# Altium project VNA.PrjPcb (part 1 of 2)
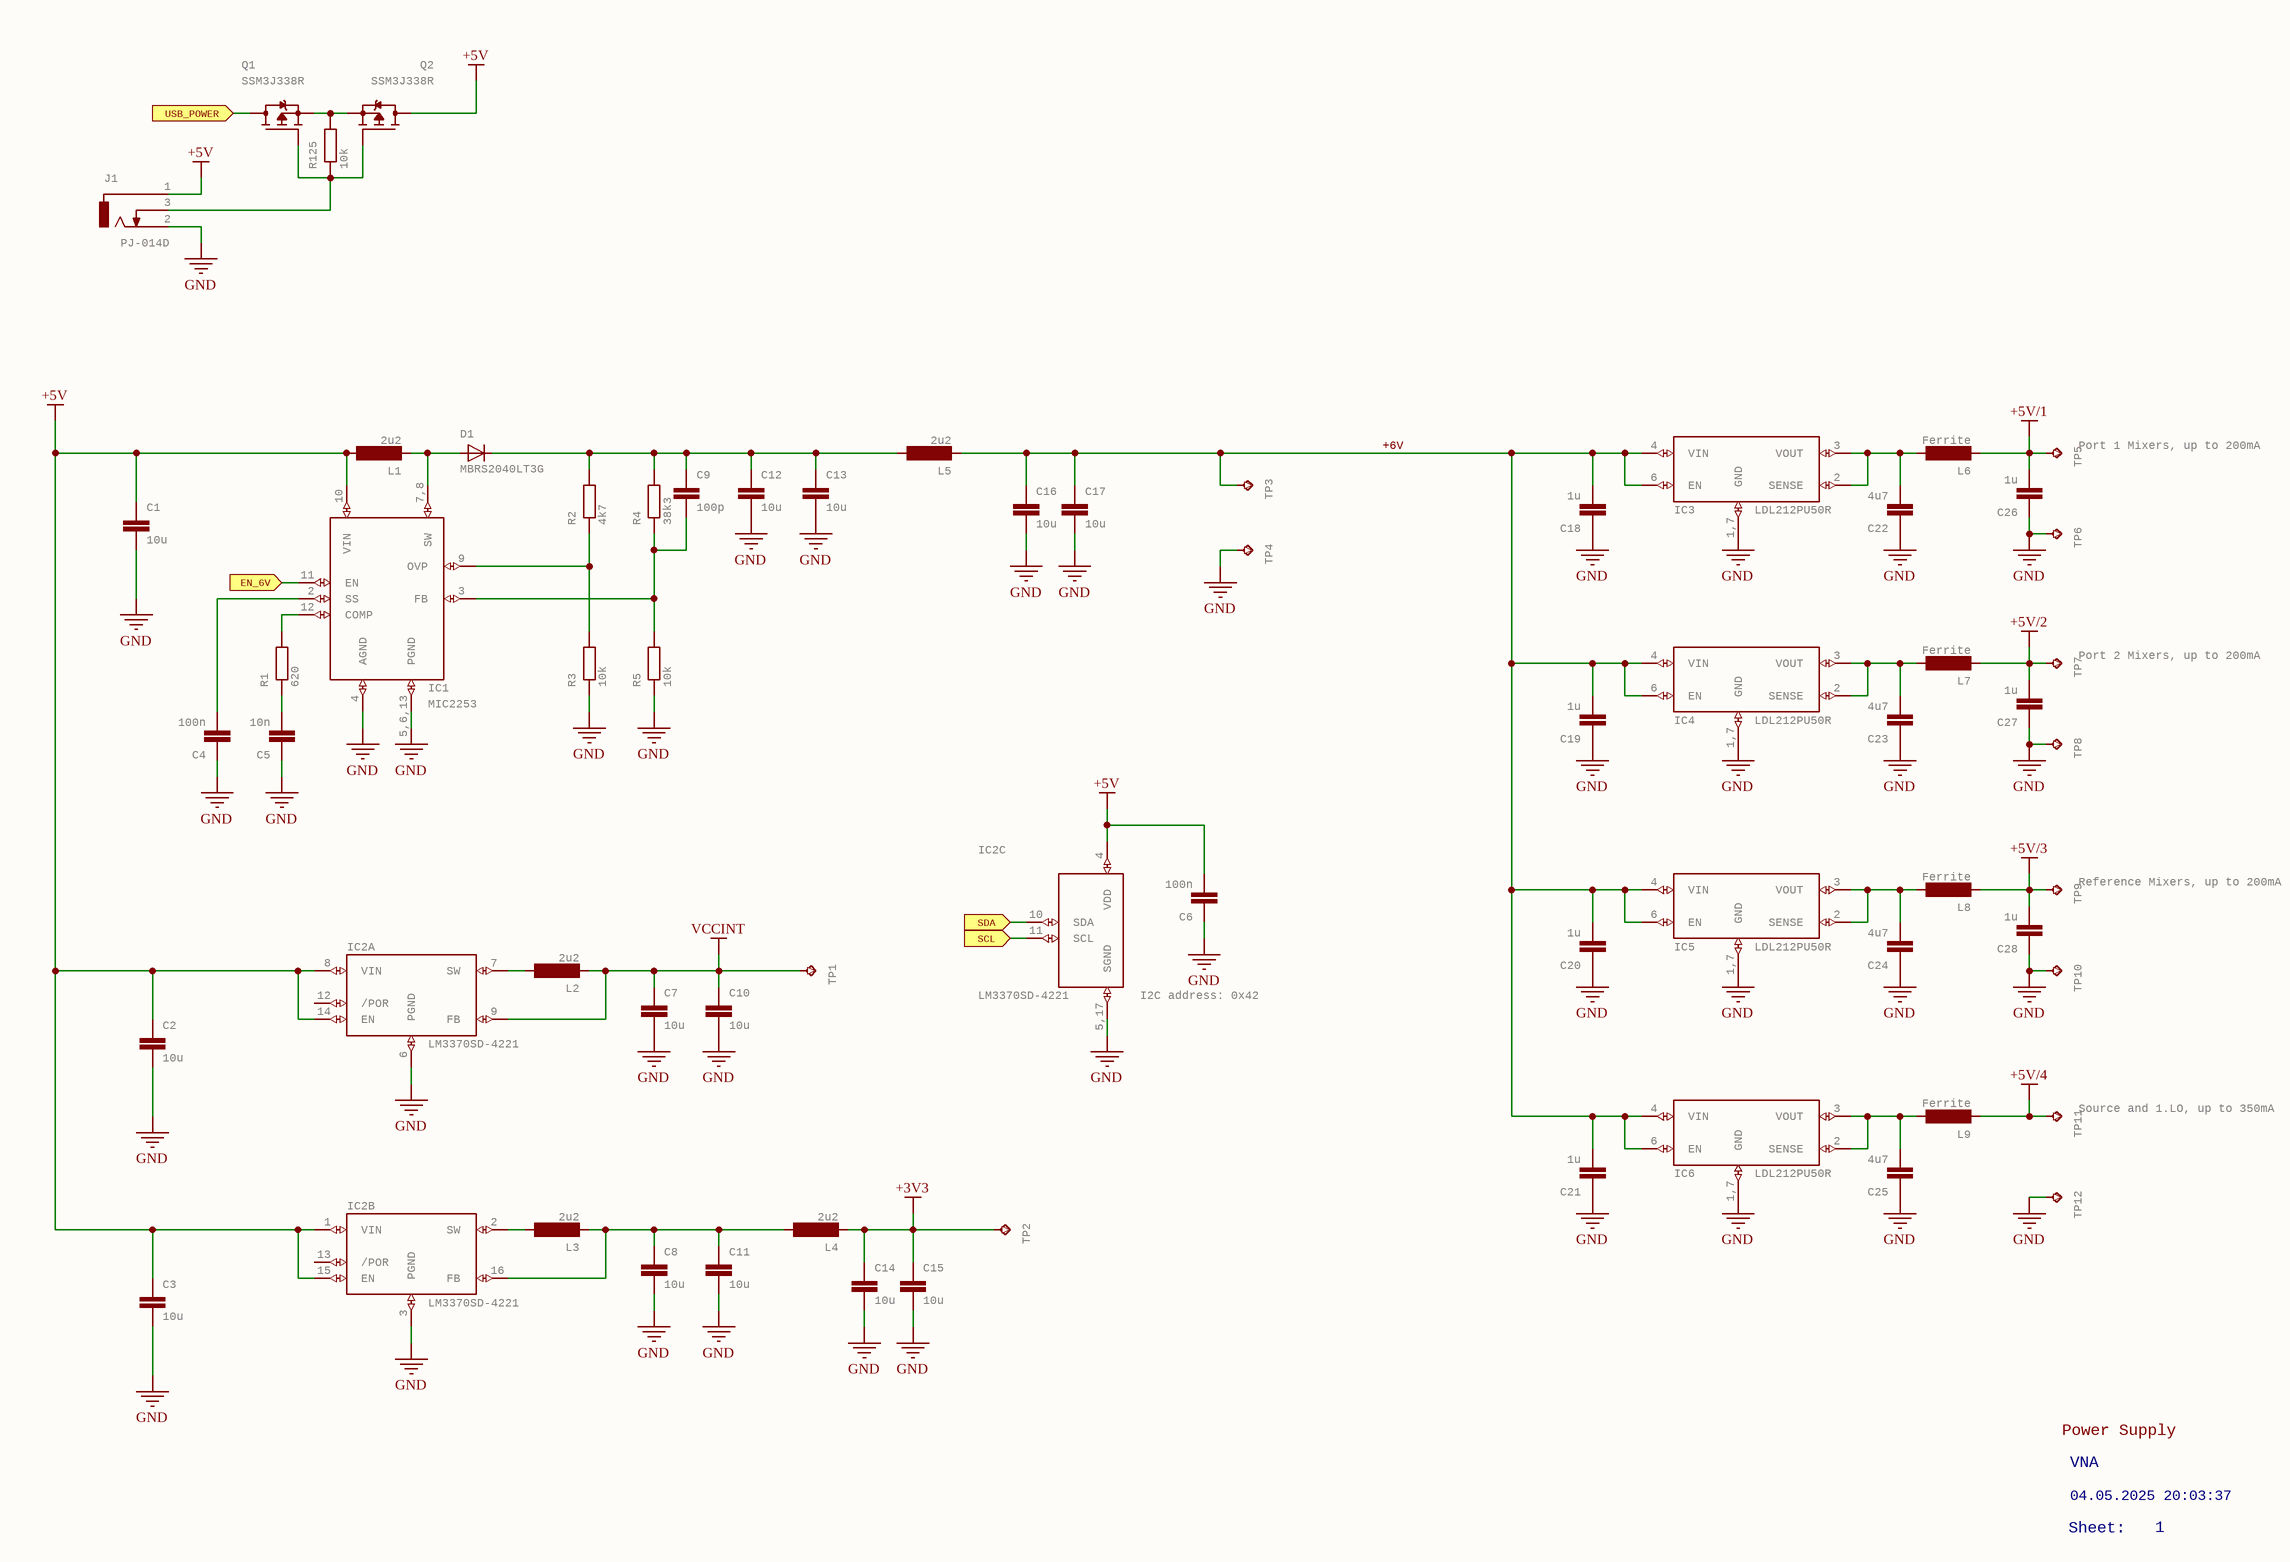
[diagram p0: VNA_0.SchDoc]
10 sheets, 590 parts. Net scope: flat (ports and power ports of the same name join across sheets).
Board file: VNA.PcbDoc
Sheets:
  VNA_0.SchDoc
  VNA_1.SchDoc
  VNA_2.SchDoc
  VNA_3.SchDoc
  VNA_4.SchDoc
  VNA_5.SchDoc
  VNA_6.SchDoc
  VNA_7.SchDoc
  VNA_8.SchDoc
  VNA_9.SchDoc

## Sheet VNA_0.SchDoc: VNA
size 409 x 289 mm; Origin: Eagle; OriginPath: C:\Users\Ground Lab\Desktop\LibreVNA\Hardware\Eagle\VNA.sch; OriginSheet: 1; Date: 04.05.2025 20:03:37; SheetNumber: 1; GateName_1: G$1; SymbolName_1: A3L-LOC; LibraryName: VNA; DeviceSetName: A3L-LOC; Sheet: Sheet:

### Parts
C1  10u  [C1206]
C2  10u  [C1206]
C3  10u  [C1206]
C4  100n  [C0402]
C5  10n  [C0402]
C6  100n  [C0402]
C7  10u  [C1206]
C8  10u  [C1206]
C9  100p  [C0402]
C10  10u  [C1206]
C11  10u  [C1206]
C12  10u  [C1206]
C13  10u  [C1206]
C14  10u  [C1206]
C15  10u  [C1206]
C16  10u  [C1206]
C17  10u  [C1206]
C18  1u  [C0603]
C19  1u  [C0603]
C20  1u  [C0603]
C21  1u  [C0603]
C22  4u7  [C0603]
C23  4u7  [C0603]
C24  4u7  [C0603]
C25  4u7  [C0603]
C26  1u  [C0603]
C27  1u  [C0603]
C28  1u  [C0603]
D1  MBRS2040LT3G  [SMB]
IC1  MIC2253  [SON50P300X300X90-13T170X240N]
IC2  LM3370SD-4221  [SON50P400X500X80-17T260X400N]  (parts A,B,C of 3)
IC3  LDL212PU50R  [SON95P300X300X100-7T170X240N]
IC4  LDL212PU50R  [SON95P300X300X100-7T170X240N]
IC5  LDL212PU50R  [SON95P300X300X100-7T170X240N]
IC6  LDL212PU50R  [SON95P300X300X100-7T170X240N]
J1  PJ-014D  [PJ-014D]
L1  2u2  [SRN5040]
L2  2u2  [SRN5040]
L3  2u2  [SRN5040]
L4  2u2  [SRN5040]
L5  2u2  [SRN5040]
L6  Ferrite  [R0402]
L7  Ferrite  [R0402]
L8  Ferrite  [R0402]
L9  Ferrite  [R0402]
Q1  SSM3J338R  [SOTFL95P240X80-3N]
Q2  SSM3J338R  [SOTFL95P240X80-3N]
R1  620  [R0402]
R2  4k7  [R0402]
R3  10k  [R0402]
R4  38k3  [R0402]
R5  10k  [R0402]
R125  10k  [R0402]
TP1  TPB1,27  [B1,27]  (value not drawn)
TP2  TPB1,27  [B1,27]  (value not drawn)
TP3  TPB1,27  [B1,27]  (value not drawn)
TP4  TPB1,27  [B1,27]  (value not drawn)
TP5  TPB1,27  [B1,27]  (value not drawn)
TP6  TPB1,27  [B1,27]  (value not drawn)
TP7  TPB1,27  [B1,27]  (value not drawn)
TP8  TPB1,27  [B1,27]  (value not drawn)
TP9  TPB1,27  [B1,27]  (value not drawn)
TP10  TPB1,27  [B1,27]  (value not drawn)
TP11  TPB1,27  [B1,27]  (value not drawn)
TP12  TPB1,27  [B1,27]  (value not drawn)

### Ports
EN_6V (in), SCL (in), SDA (in), USB_POWER (in)

### Nets
+3V3: C14.1 C15.1 L4.P$2 TP2.TP
+5V: C1.1 C2.1 C3.1 C6.2 IC1.10(VIN) IC2.1(VIN) IC2.4(VDD) IC2.8(VIN) IC2.14(EN) IC2.15(EN) J1.1 L1.P$1 Q2.3(D)
+5V/1: C26.2 L6.2 TP5.TP
+5V/2: C27.2 L7.2 TP7.TP
+5V/3: C28.2 L8.2 TP9.TP
+5V/4: L9.2 TP11.TP
GND: C1.2 C2.2 C3.2 C4.1 C5.1 C6.1 C7.2 C8.2 C10.2 C11.2 C12.2 C13.2 C14.2 C15.2 C16.2 C17.2 C18.1 C19.1 C20.1 C21.1 C22.1 C23.1 C24.1 C25.1 C26.1 C27.1 C28.1 IC1.4(AGND) IC1.5,6,13(PGND) IC2.3(PGND) IC2.5,17(SGND) IC2.6(PGND) IC3.1,7(GND) IC4.1,7(GND) IC5.1,7(GND) IC6.1,7(GND) J1.2 R3.1 R5.1 TP4.TP TP6.TP TP8.TP TP10.TP TP12.TP
VCCINT: C7.1 C10.1 IC2.9(FB) L2.P$2 TP1.TP
+6V: C16.1 C17.1 C18.2 C19.2 C20.2 C21.2 IC3.4(VIN) IC3.6(EN) IC4.4(VIN) IC4.6(EN) IC5.4(VIN) IC5.6(EN) IC6.4(VIN) IC6.6(EN) L5.P$2 TP3.TP
NetC4_2: C4.2 IC1.2(SS)
NetC5_2: C5.2 R1.1
NetC8_1: C8.1 C11.1 IC2.16(FB) L3.P$2 L4.P$1
NetC9_1: C9.1 C12.1 C13.1 D1.C L5.P$1 R2.2 R4.2
NetC9_2: C9.2 IC1.3(FB) R4.1 R5.2
NetC22_2: C22.2 IC3.2(SENSE) IC3.3(VOUT) L6.1
NetC23_2: C23.2 IC4.2(SENSE) IC4.3(VOUT) L7.1
NetC24_2: C24.2 IC5.2(SENSE) IC5.3(VOUT) L8.1
NetC25_2: C25.2 IC6.2(SENSE) IC6.3(VOUT) L9.1
NetD1_A: D1.A IC1.7,8(SW) L1.P$2
NetIC1_9: IC1.9(OVP) R2.1 R3.2
NetIC1_11: IC1.11(EN) ; port EN_6V
NetIC1_12: IC1.12(COMP) R1.2
NetIC2_2: IC2.2(SW) L3.P$1
NetIC2_7: IC2.7(SW) L2.P$1
NetIC2_10: IC2.10(SDA) ; port SDA
NetIC2_11: IC2.11(SCL) ; port SCL
NetJ1_3: J1.3 Q1.1(G) Q2.1(G) R125.1
NetJ4_2,11: Q1.3(D) ; port USB_POWER
NetQ1_2: Q1.2(S) Q2.2(S) R125.2

Not connected (* = marked no-connect by the designer): IC2 12(/POR) 13(/POR)

### Notes on the sheet
- (near TP5) Port 1 Mixers, up to 200mA
- (near TP7) Port 2 Mixers, up to 200mA
- (near TP9) Reference Mixers, up to 200mA
- (near IC2) I2C address: 0x42
- (near TP11) Source and 1.LO, up to 350mA
- Power Supply
- VNA
- Sheet:
- 04.05.2025 20:03:37
- 1

### Library data of the parts
C1-C3 C7 C8 C10-C17 = C-EUC1206: CAPACITOR, European symbol; GateName_1: G$1; SymbolName_1: C-EU; DeviceName: C1206; LibraryName: VNA; DeviceSetName: C-EU
C4-C6 C9 = C-EU*?:2C0402: CAPACITOR, European symbol; GateName_1: G$1; SymbolName_1: C-EU:1; DeviceName: C0402; LibraryName: VNA; DeviceSetName: C-EU*?:2
C18-C28 = C-EU*?:1C0603: CAPACITOR, European symbol; GateName_1: G$1; SymbolName_1: C-EU-1; DeviceName: C0603; LibraryName: VNA; DeviceSetName: C-EU*?:1
D1 = D-SMB: DIODE; GateName_1: G$1; SymbolName_1: D; DeviceSetName: D-; DeviceName: SMB; LibraryName: VNA
IC1 = MIC2253: GateName_1: G$1; SymbolName_1: MIC2253; LibraryName: VNA; DeviceSetName: MIC2253
IC2 = LM3370: GateName_1: BUCK1; SymbolName_1: LM3370_BUCK; GateName_2: BUCK2; GateName_3: CONTROL; SymbolName_3: LM3370_CONTROL; SymbolName_2: LM3370_BUCK; LibraryName: VNA; DeviceSetName: LM3370
IC3-IC6 = LDL212PU50R: GateName_1: G$1; SymbolName_1: LDL212; LibraryName: VNA; DeviceSetName: LDL212PU50R
J1 = PJ-014D: GateName_1: G$1; SymbolName_1: DC-JACK-SWITCH; LibraryName: VNA; DeviceSetName: PJ-014D
L1-L5 = SRN5040: GateName_1: G$1; SymbolName_1: L-EU; LibraryName: VNA; DeviceSetName: SRN5040
L6-L9 = FERRITE: GateName_1: G$1; SymbolName_1: L-EU:1; LibraryName: VNA; DeviceSetName: FERRITE
Q1 Q2 = SSM3J338R: GateName_1: G$1; SymbolName_1: P-MOSFET; LibraryName: VNA; DeviceSetName: SSM3J338R
R1-R5 R125 = R-EU_R0402: RESISTOR, European symbol; GateName_1: G$1; SymbolName_1: R-EU; DeviceSetName: R-EU_; DeviceName: R0402; LibraryName: VNA
TP1-TP12 = TPB1,27: Test pad; GateName_1: G$1; SymbolName_1: TP; DeviceName: B1,27; LibraryName: VNA; DeviceSetName: TP

## Sheet VNA_1.SchDoc: VNA
size 409 x 289 mm; Origin: Eagle; OriginPath: C:\Users\Ground Lab\Desktop\LibreVNA\Hardware\Eagle\VNA.sch; OriginSheet: 2; OriginDescription: CLK Generation; Date: 04.05.2025 20:03:37; SheetNumber: 2; GateName_1: G$1; SymbolName_1: A3L-LOC; LibraryName: VNA; DeviceSetName: A3L-LOC; Sheet: Sheet:
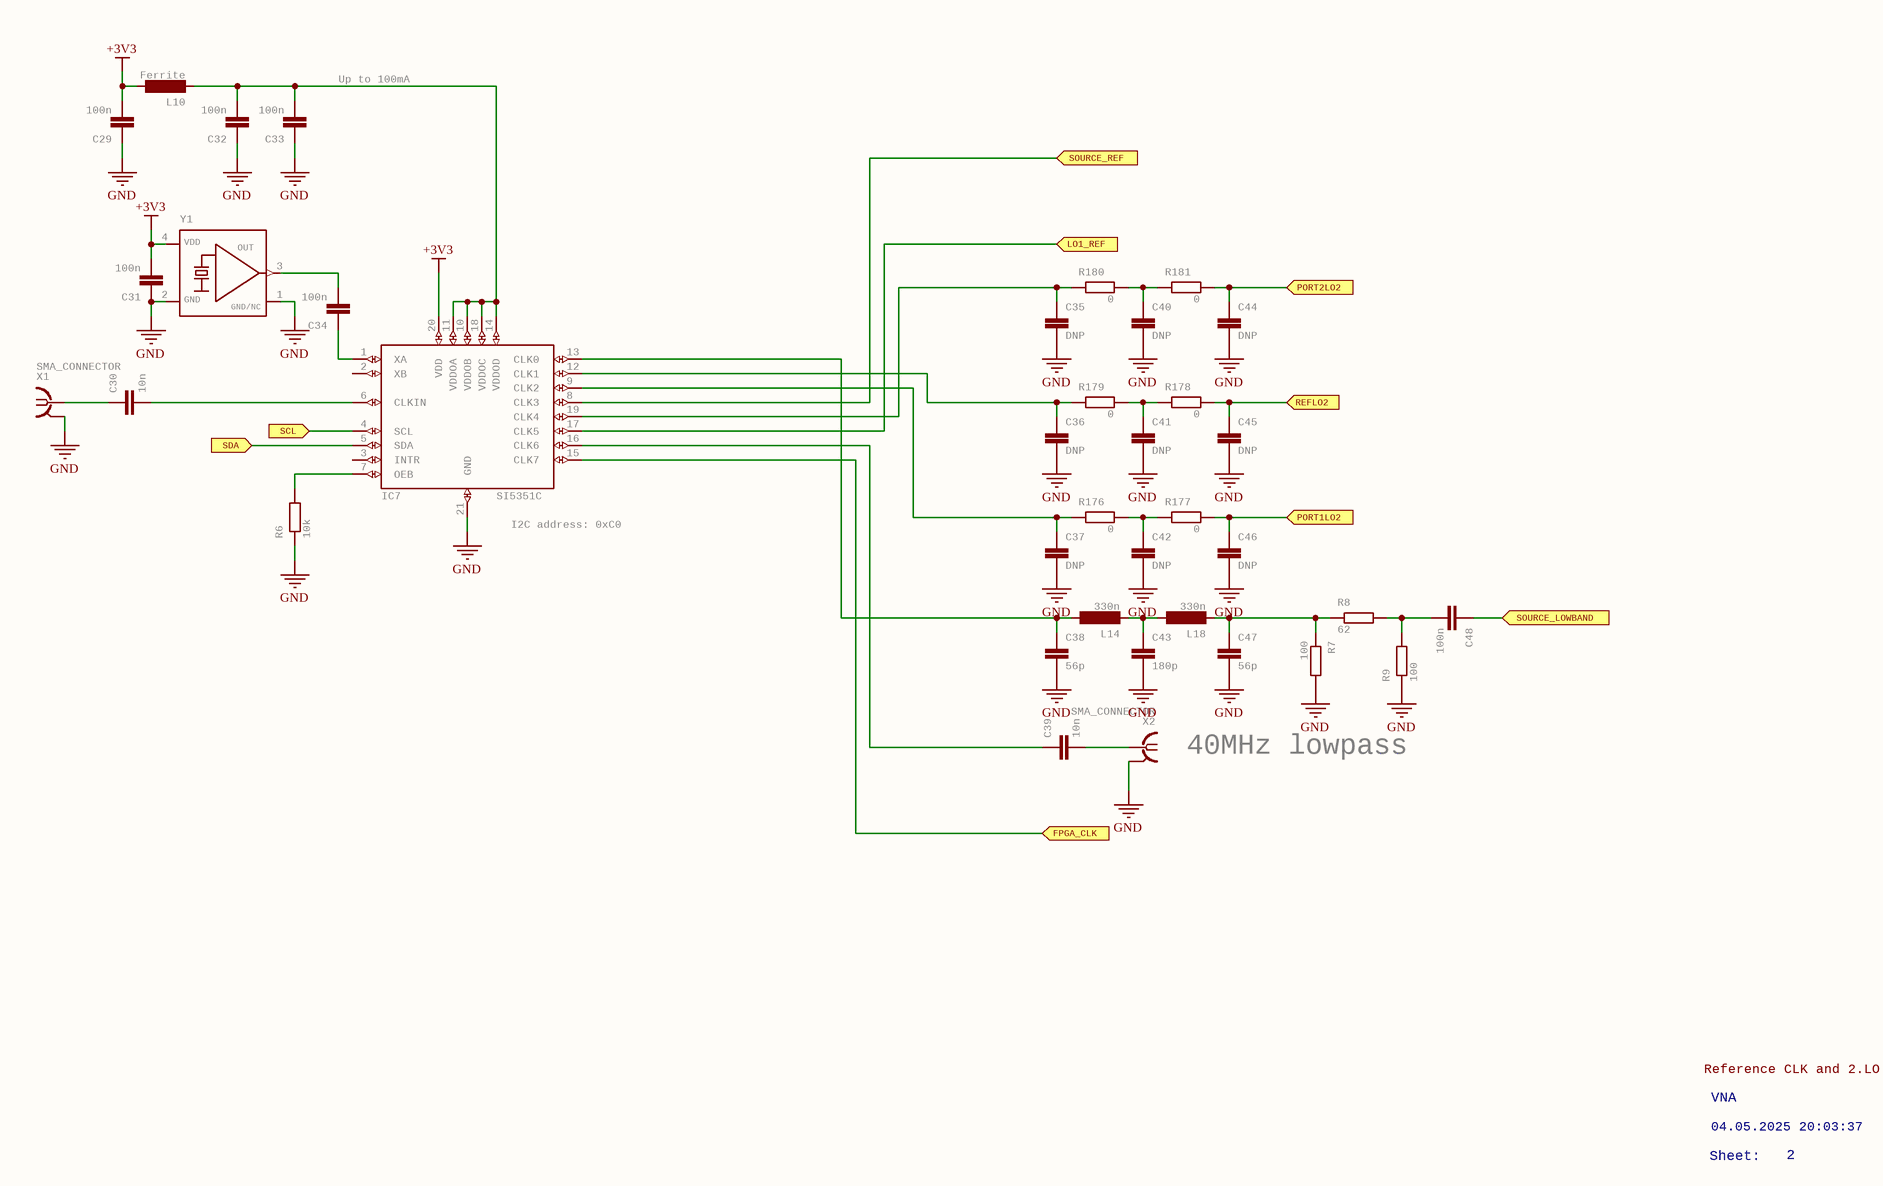
[diagram p1: VNA_1.SchDoc]

### Parts
C29  100n  [C0402]
C30  10n  [C0402]
C31  100n  [C0402]
C32  100n  [C0402]
C33  100n  [C0402]
C34  100n  [C0402]
C35  DNP  [C0402]
C36  DNP  [C0402]
C37  DNP  [C0402]
C38  56p  [C0402]
C39  10n  [C0402]
C40  DNP  [C0402]
C41  DNP  [C0402]
C42  DNP  [C0402]
C43  180p  [C0402]
C44  DNP  [C0402]
C45  DNP  [C0402]
C46  DNP  [C0402]
C47  56p  [C0402]
C48  100n  [C0402]
IC7  SI5351C  [QFN50P400X400X90-21T270N]
L10  Ferrite  [R0402]
L14  330n  [L0402]
L18  330n  [L0402]
R6  10k  [R0402]
R7  100  [R0402]
R8  62  [R0402]
R9  100  [R0402]
R176  0  [R0402]
R177  0  [R0402]
R178  0  [R0402]
R179  0  [R0402]
R180  0  [R0402]
R181  0  [R0402]
X1  SMA_CONNECTOR  [J502-ND-142-0711-821/826]
X2  SMA_CONNECTOR  [J502-ND-142-0711-821/826]
Y1  DSB221SDN/26MHz  [2.5X2.0_KXO-86-TCXO]  (value not drawn)

### Ports
FPGA_CLK (in), LO1_REF (in), PORT1LO2 (in), PORT2LO2 (in), REFLO2 (in), SCL (in), SDA (in), SOURCE_LOWBAND (in), SOURCE_REF (in)

### Nets
+3V3: C29.2 C31.2 IC7.20(VDD) L10.1 Y1.4(VDD)
GND: C29.1 C31.1 C32.1 C33.1 C35.2 C36.2 C37.2 C38.2 C40.2 C41.2 C42.2 C43.2 C44.2 C45.2 C46.2 C47.2 IC7.21(GND) R6.1 R7.2 R9.1 X1.G@1-4 X2.G@1-4 Y1.1(GND/NC) Y1.2(GND)
NetC30_1: C30.1 X1.1
NetC30_2: C30.2 IC7.6(CLKIN)
NetC32_2: C32.2 C33.2 IC7.10(VDDOB) IC7.11(VDDOA) IC7.14(VDDOD) IC7.18(VDDOC) L10.2
NetC34_1: C34.1 IC7.1(XA)
NetC34_2: C34.2 Y1.3(OUT)
NetC35_1: C35.1 IC7.19(CLK4) R180.1
NetC36_1: C36.1 C37.1 IC7.9(CLK2) IC7.12(CLK1) IC7.17(CLK5) R176.1 R179.1 ; port LO1_REF
NetC38_1: C38.1 IC7.13(CLK0) L14.1
NetC39_1: C39.1 IC7.16(CLK6)
NetC39_2: C39.2 X2.1
NetC40_1: C40.1 R180.2 R181.1
NetC41_1: C41.1 R178.1 R179.2
NetC42_1: C42.1 R176.2 R177.1
NetC43_1: C43.1 L14.2 L18.1
NetC44_1: C44.1 R181.2 ; port PORT2LO2
NetC45_1: C45.1 R178.2 ; port REFLO2
NetC46_1: C46.1 R177.2 ; port PORT1LO2
NetC47_1: C47.1 L18.2 R7.1 R8.1
NetC48_1: C48.1 ; port SOURCE_LOWBAND
NetC48_2: C48.2 R8.2 R9.2
NetC51_1: IC7.8(CLK3) ; port SOURCE_REF
NetIC2_10: IC7.5(SDA) ; port SDA
NetIC2_11: IC7.4(SCL) ; port SCL
NetIC7_7: IC7.7(OEB) R6.2
NetIC7_15: IC7.15(CLK7) ; port FPGA_CLK

Not connected (* = marked no-connect by the designer): IC7 2(XB) 3(INTR)

### Notes on the sheet
- (near C33) Up to 100mA
- (near IC7) I2C address: 0xC0
- 40MHz lowpass
- Reference CLK and 2.LO
- VNA
- Sheet:
- 04.05.2025 20:03:37
- 2

### Library data of the parts
C29-C48 = C-EU*?:2C0402: as C4 on sheet VNA_0; DeviceName: C0402; LibraryName: VNA; DeviceSetName: C-EU*?:2
IC7 = SI5351C: GateName_1: G$1; SymbolName_1: SI5351C; LibraryName: VNA; DeviceSetName: SI5351C
L10 = FERRITE: GateName_1: G$1; SymbolName_1: L-EU:1; LibraryName: VNA; DeviceSetName: FERRITE
L14 L18 = INDUCTOR0402: GateName_1: G$1; SymbolName_1: L-EU:1; DeviceName: 0402; LibraryName: VNA; DeviceSetName: INDUCTOR
R6-R9 R176-R181 = R-EU_R0402: as R1 on sheet VNA_0; DeviceName: R0402; LibraryName: VNA
X1 X2 = SMA_CONNECTOR: GateName_1: G$1; SymbolName_1: BNC-FGND; LibraryName: VNA; DeviceSetName: SMA_CONNECTOR
Y1 = KXO-TCXO-CMOS-86: TCXO : CMOS - Serie                  	                 Model    	          Size l/w/h [mm]    	          Frequency Range    	          Frequency       Stability    	          Temp. Range [Â°C]    	          Output           	          AECQ 200       availabel    	          Datasheet    	                 KXO-86       KXO-84       KXO-83       KXO-82           	          2.5/2.0/0.7       3.2/2.5/1.0        5.0/3.2/1.5       7.0/5.0/2.4      	           13,0 ~ 40,0 MHz        10,0 ~ 40,0 MHz        10,0 ~ 40,0 MHz        10,0 ~ 30,0 MHz     	          Â±1,0 â€¦ Â±2,5ppm       Â±1,0 â€¦ Â±2,5ppm       Â±1,0 â€¦ Â±3,0ppm       Â±1,0 â€¦ Â±3,0ppm     	           (*) -30Â°C â€¦+75Â°C        (*) -40Â°C â€¦+85Â°C        (*) -40Â°C â€¦+85Â°C        (*) -30Â°C â€¦+80Â°C     	           CMOS        CMOS        CMOS        CMOS     	          -       -       -       -     	          KXO-86.pdf       KXO-84.pdf       KXO-83.pdf       KXO-82.pdf     	  	       Details see: http://www.geyer-electronic.de/Frequenz-Produkte.9.0.html   Created 2016-06-07, Hans Locher 2016 (C) Geyer Quartz Technology   KXO86,KXO84,KXO83,KXO82;2550;3225;5032;7050;2,5x2,0;3,2x2,5;2.5x2.0;3.2x2.5,5,0x3,2;7,0x5,0,5.0x3.2,7.0x5.0; GateName_1: G$1; SymbolName_1: QTCXO-HCMOS; DeviceName: -86; LibraryName: crystal-geyer_V1_0; DeviceSetName: KXO-TCXO-CMOS; OUT: OUT; GND: GND; VDD: VDD; GND/NC: GND/NC

## Sheet VNA_2.SchDoc: VNA
size 409 x 289 mm; Origin: Eagle; OriginPath: C:\Users\Ground Lab\Desktop\LibreVNA\Hardware\Eagle\VNA.sch; OriginSheet: 3; OriginDescription: Source; Date: 04.05.2025 20:03:37; SheetNumber: 3; GateName_1: G$1; SymbolName_1: A3L-LOC; LibraryName: VNA; DeviceSetName: A3L-LOC; Sheet: Sheet:
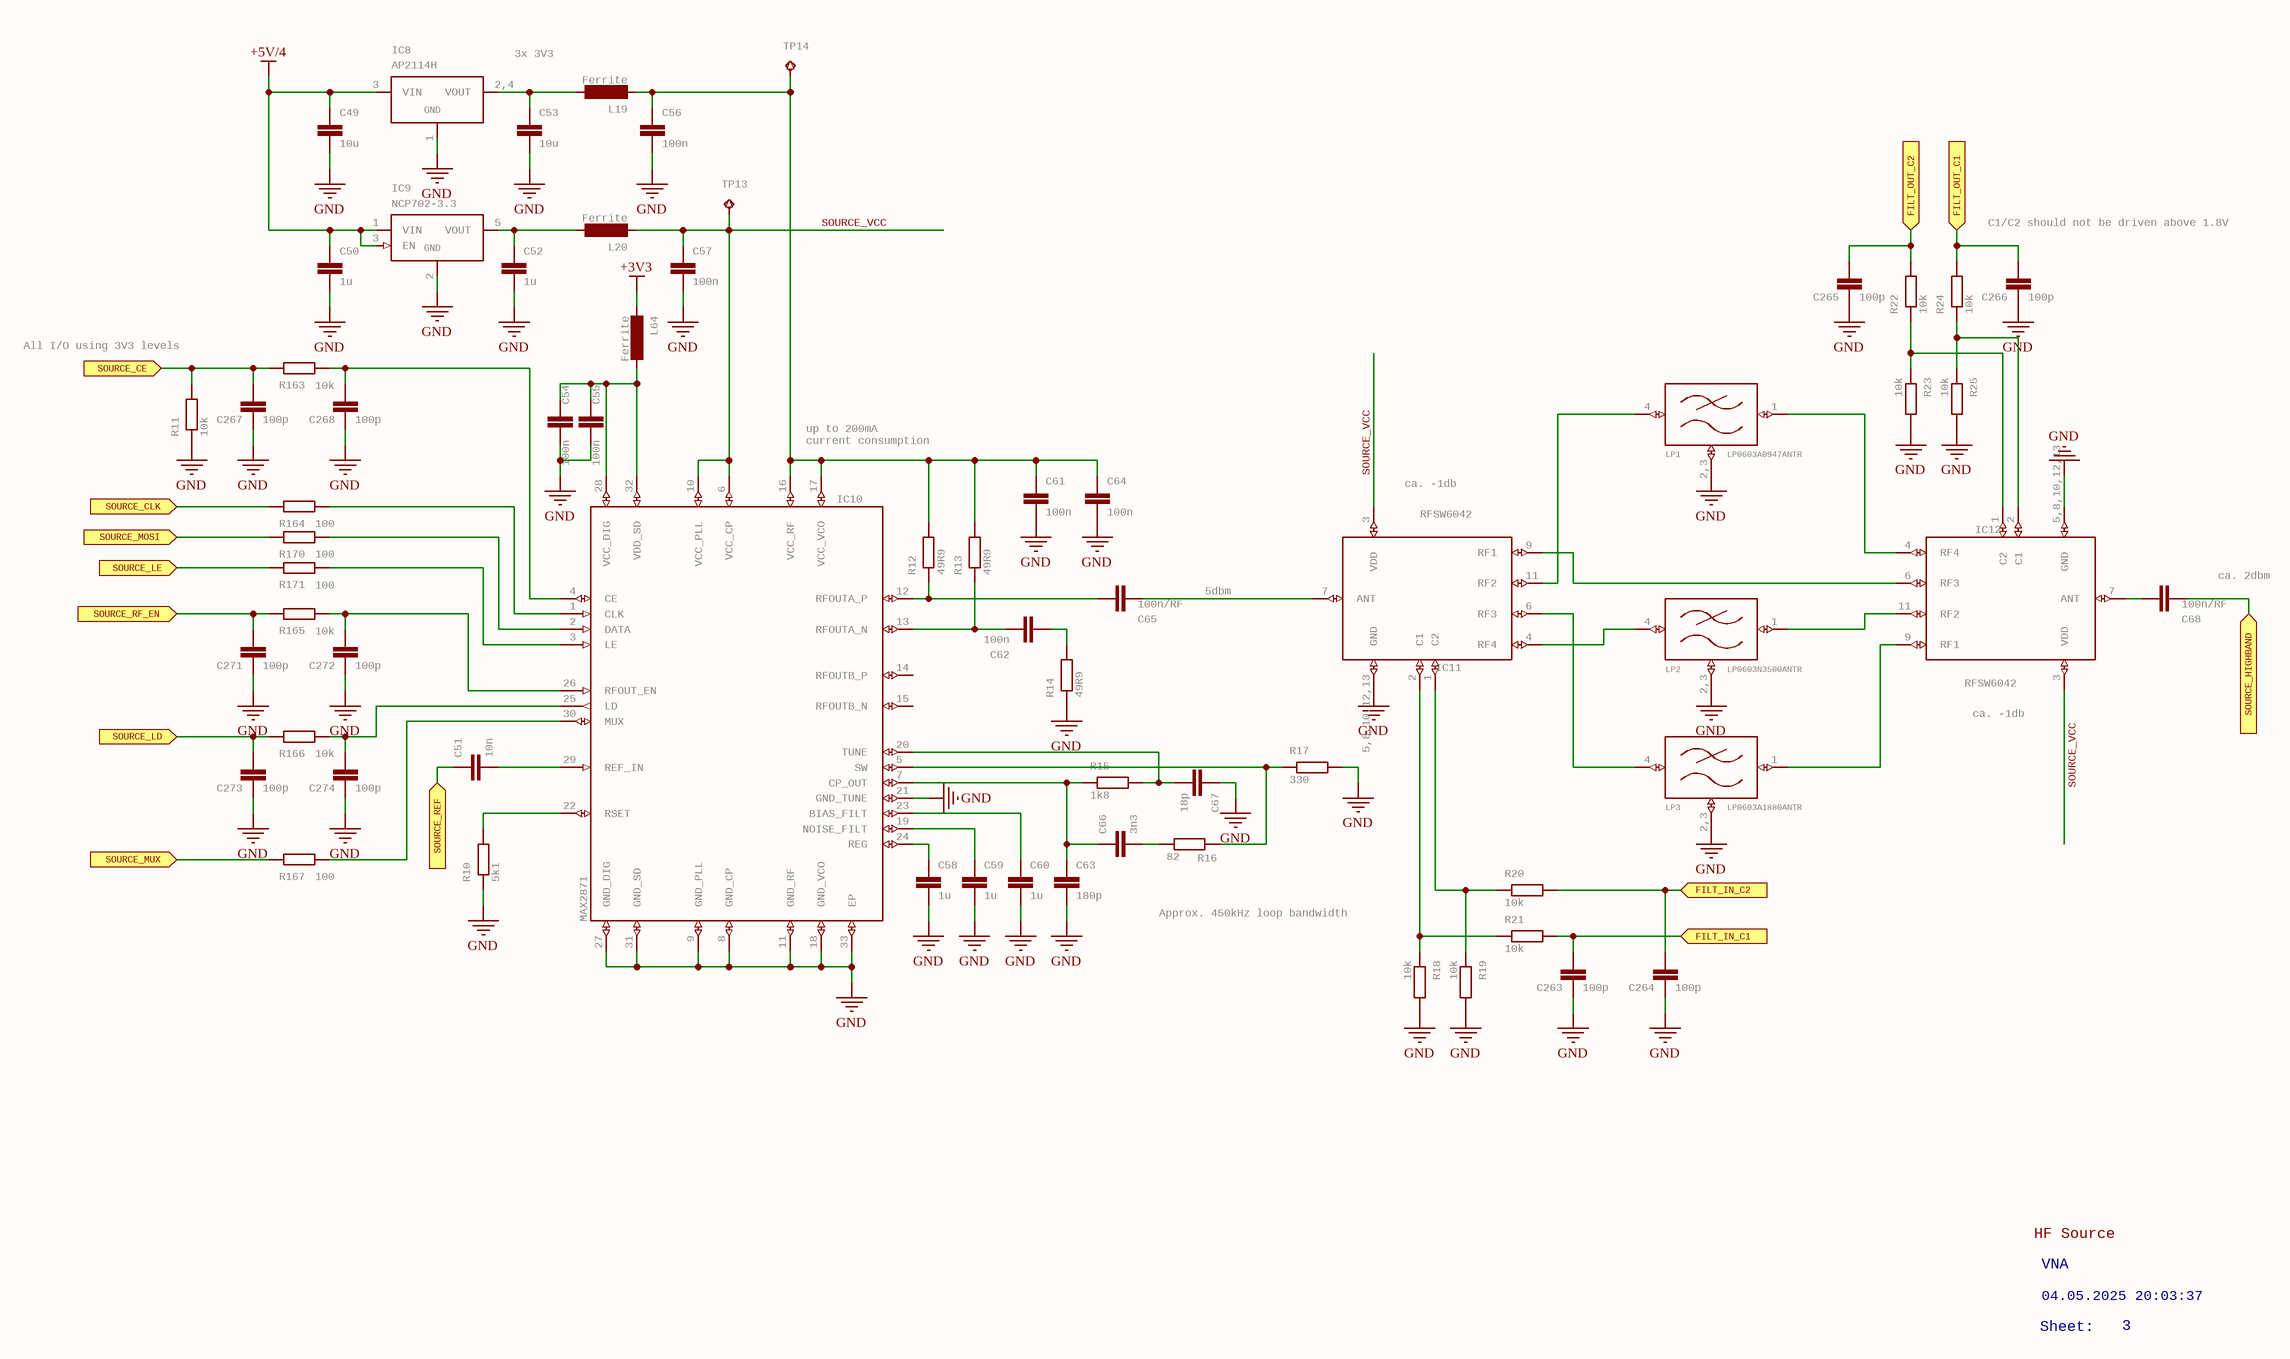
[diagram p2: VNA_2.SchDoc]

### Parts
C49  10u  [C1206]
C50  1u  [C0603]
C51  10n  [C0402]
C52  1u  [C0603]
C53  10u  [C1206]
C54  100n  [C0402]
C55  100n  [C0402]
C56  100n  [C0402]
C57  100n  [C0402]
C58  1u  [C0402]
C59  1u  [C0402]
C60  1u  [C0402]
C61  100n  [C0402]
C62  100n  [C0402]
C63  180p  [C0402]
C64  100n  [C0402]
C65  100n/RF  [C0402]
C66  3n3  [C0402]
C67  18p  [C0402]
C68  100n/RF  [C0402]
C263  100p  [C0402]
C264  100p  [C0402]
C265  100p  [C0402]
C266  100p  [C0402]
C267  100p  [C0402]
C268  100p  [C0402]
C271  100p  [C0402]
C272  100p  [C0402]
C273  100p  [C0402]
C274  100p  [C0402]
IC8  AP2114H  [SOT230P700X180-4]
IC9  NCP702-3.3  [SOT95P240X110-5]
IC10  MAX2871  [QFN50P500X500X80-33T310]
IC11  RFSW6042  [QFN40P180X180X55-13T76N]
IC12  RFSW6042  [QFN40P180X180X55-13T76N]
L19  Ferrite  [R0402]
L20  Ferrite  [R0402]
L64  Ferrite  [R0402]
LP1  LP0603A0947ANTR  [FILTRDFN160X84X70-4N]
LP2  LP0603N3500ANTR  [FILTRDFN160X84X70-4N]
LP3  LP0603A1880ANTR  [FILTRDFN160X84X70-4N]
R10  5k1  [R0402]
R11  10k  [R0402]
R12  49R9  [R0402]
R13  49R9  [R0402]
R14  49R9  [R0402]
R15  1k8  [R0402]
R16  82  [R0402]
R17  330  [R0402]
R18  10k  [R0402]
R19  10k  [R0402]
R20  10k  [R0402]
R21  10k  [R0402]
R22  10k  [R0402]
R23  10k  [R0402]
R24  10k  [R0402]
R25  10k  [R0402]
R163  10k  [R0402]
R164  100  [R0402]
R165  10k  [R0402]
R166  10k  [R0402]
R167  100  [R0402]
R170  100  [R0402]
R171  100  [R0402]
TP13  TPB1,27  [B1,27]  (value not drawn)
TP14  TPB1,27  [B1,27]  (value not drawn)

### Ports
FILT_IN_C1 (in), FILT_IN_C2 (in), FILT_OUT_C1 (in), FILT_OUT_C2 (in), SOURCE_CE (in), SOURCE_CLK (in), SOURCE_HIGHBAND (in), SOURCE_LD (in), SOURCE_LE (in), SOURCE_MOSI (in), SOURCE_MUX (in), SOURCE_REF (in), SOURCE_RF_EN (in)

### Nets
+3V3: L64.2
+5V/4: C49.1 C50.1 IC8.3(VIN) IC9.1(VIN) IC9.3(EN)
GND: C49.2 C50.2 C52.2 C53.2 C54.2 C55.2 C56.2 C57.2 C58.2 C59.2 C60.2 C61.2 C63.2 C64.2 C67.1 C263.2 C264.2 C265.2 C266.2 C267.2 C268.2 C271.2 C272.2 C273.2 C274.2 IC8.1(GND) IC9.2(GND) IC10.8(GND_CP) IC10.9(GND_PLL) IC10.11(GND_RF) IC10.18(GND_VCO) IC10.21(GND_TUNE) IC10.27(GND_DIG) IC10.31(GND_SD) IC10.33(EP) IC11.5,8,10,12,13(GND) IC12.5,8,10,12,13(GND) LP1.2,3(GND) LP2.2,3(GND) LP3.2,3(GND) R10.1 R11.1 R14.1 R17.2 R18.2 R19.2 R23.2 R25.2
SOURCE_VCC: C57.1 IC10.6(VCC_CP) IC10.10(VCC_PLL) IC11.3(VDD) IC12.3(VDD) L20.2 TP13.TP
NetC51_1: C51.1 ; port SOURCE_REF
NetC51_2: C51.2 IC10.29(REF_IN)
NetC52_1: C52.1 IC9.5(VOUT) L20.1
NetC53_1: C53.1 IC8.2,4(VOUT) L19.1
NetC54_1: C54.1 C55.1 IC10.28(VCC_DIG) IC10.32(VDD_SD) L64.1
NetC56_1: C56.1 C61.1 C64.1 IC10.16(VCC_RF) IC10.17(VCC_VCO) L19.2 R12.2 R13.2 TP14.TP
NetC58_1: C58.1 IC10.24(REG)
NetC59_1: C59.1 IC10.19(NOISE_FILT)
NetC60_1: C60.1 IC10.23(BIAS_FILT)
NetC62_1: C62.1 R14.2
NetC62_2: C62.2 IC10.13(RFOUTA_N) R13.1
NetC63_1: C63.1 C66.1 IC10.7(CP_OUT) R15.1
NetC65_1: C65.1 IC10.12(RFOUTA_P) R12.1
NetC65_2: C65.2 IC11.7(ANT)
NetC66_2: C66.2 R16.1
NetC67_2: C67.2 IC10.20(TUNE) R15.2
NetC68_1: C68.1 IC12.7(ANT)
NetC68_2: C68.2 ; port SOURCE_HIGHBAND
NetC263_1: C263.1 R21.2 ; port FILT_IN_C1
NetC264_1: C264.1 R20.2 ; port FILT_IN_C2
NetC265_1: C265.1 R22.2 ; port FILT_OUT_C2
NetC266_1: C266.1 R24.2 ; port FILT_OUT_C1
NetC267_1: C267.1 R11.2 R163.2 ; port SOURCE_CE
NetC268_1: C268.1 IC10.4(CE) R163.1
NetC271_1: C271.1 R165.2 ; port SOURCE_RF_EN
NetC272_1: C272.1 IC10.26(RFOUT_EN) R165.1
NetC273_1: C273.1 R166.2 ; port SOURCE_LD
NetC274_1: C274.1 IC10.25(LD) R166.1
NetIC10_1: IC10.1(CLK) R164.1
NetIC10_2: IC10.2(DATA) R170.1
NetIC10_3: IC10.3(LE) R171.1
NetIC10_5: IC10.5(SW) R16.2 R17.1
NetIC10_22: IC10.22(RSET) R10.2
NetIC10_30: IC10.30(MUX) R167.1
NetIC11_1: IC11.1(C2) R19.1 R20.1
NetIC11_2: IC11.2(C1) R18.1 R21.1
NetIC11_4: IC11.4(RF4) LP2.4(IN)
NetIC11_6: IC11.6(RF3) LP3.4(IN)
NetIC11_9: IC11.9(RF1) IC12.6(RF3)
NetIC11_11: IC11.11(RF2) LP1.4(IN)
NetIC12_1: IC12.1(C2) IC12.2(C1) R22.1 R23.1 R24.1 R25.1
NetIC12_4: IC12.4(RF4) LP1.1(OUT)
NetIC12_9: IC12.9(RF1) LP3.1(OUT)
NetIC12_11: IC12.11(RF2) LP2.1(OUT)
NetR164_2: R164.2 ; port SOURCE_CLK
NetR167_2: R167.2 ; port SOURCE_MUX
NetR170_2: R170.2 ; port SOURCE_MOSI
NetR171_2: R171.2 ; port SOURCE_LE

Not connected (* = marked no-connect by the designer): IC10 14(RFOUTB_P) 15(RFOUTB_N)

### Notes on the sheet
- 3x 3V3
- C1/C2 should not be driven above 1.8V
- (near R11) All I/O using 3V3 levels
- up to 200mA
  current consumption
- (near IC11) ca. -1db
- 5dbm
- (near C68) ca. 2dbm
- (near IC12) ca. -1db
- Approx. 450kHz loop bandwidth
- HF Source
- VNA
- Sheet:
- 04.05.2025 20:03:37
- 3

### Library data of the parts
C49 C53 = C-EUC1206: as C1 on sheet VNA_0; DeviceName: C1206; LibraryName: VNA; DeviceSetName: C-EU
C50 C52 = C-EU*?:1C0603: as C18 on sheet VNA_0; DeviceName: C0603; LibraryName: VNA; DeviceSetName: C-EU*?:1
C51 C54-C68 C263-C268 C271-C274 = C-EU*?:2C0402: as C4 on sheet VNA_0; DeviceName: C0402; LibraryName: VNA; DeviceSetName: C-EU*?:2
IC8 = AP2114H: GateName_1: G$1; SymbolName_1: VREG; DeviceName: H; DeviceSetName: AP2114; LibraryName: VNA; GND: GND
IC9 = NCP702: GateName_1: G$1; SymbolName_1: VREG_EN; LibraryName: VNA; DeviceSetName: NCP702; GND: GND
IC10 = MAX2871: GateName_1: G$1; SymbolName_1: MAX2871; LibraryName: VNA; DeviceSetName: MAX2871
IC11 IC12 = RFSW6042: GateName_1: G$1; SymbolName_1: RFSW6042; LibraryName: VNA; DeviceSetName: RFSW6042
L19 L20 L64 = FERRITE: GateName_1: G$1; SymbolName_1: L-EU:1; LibraryName: VNA; DeviceSetName: FERRITE
LP1-LP3 = LP0603A: GateName_1: G$1; SymbolName_1: LOWPASS; LibraryName: VNA; DeviceSetName: LP0603A
R10-R25 R163-R167 R170 R171 = R-EU_R0402: as R1 on sheet VNA_0; DeviceName: R0402; LibraryName: VNA
TP13 TP14 = TPB1,27: as TP1 on sheet VNA_0; DeviceName: B1,27; LibraryName: VNA; DeviceSetName: TP

## Sheet VNA_3.SchDoc: VNA
size 409 x 289 mm; Origin: Eagle; OriginPath: C:\Users\Ground Lab\Desktop\LibreVNA\Hardware\Eagle\VNA.sch; OriginSheet: 4; Date: 04.05.2025 20:03:37; SheetNumber: 4; GateName_1: G$1; SymbolName_1: A3L-LOC; LibraryName: VNA; DeviceSetName: A3L-LOC; Sheet: Sheet:
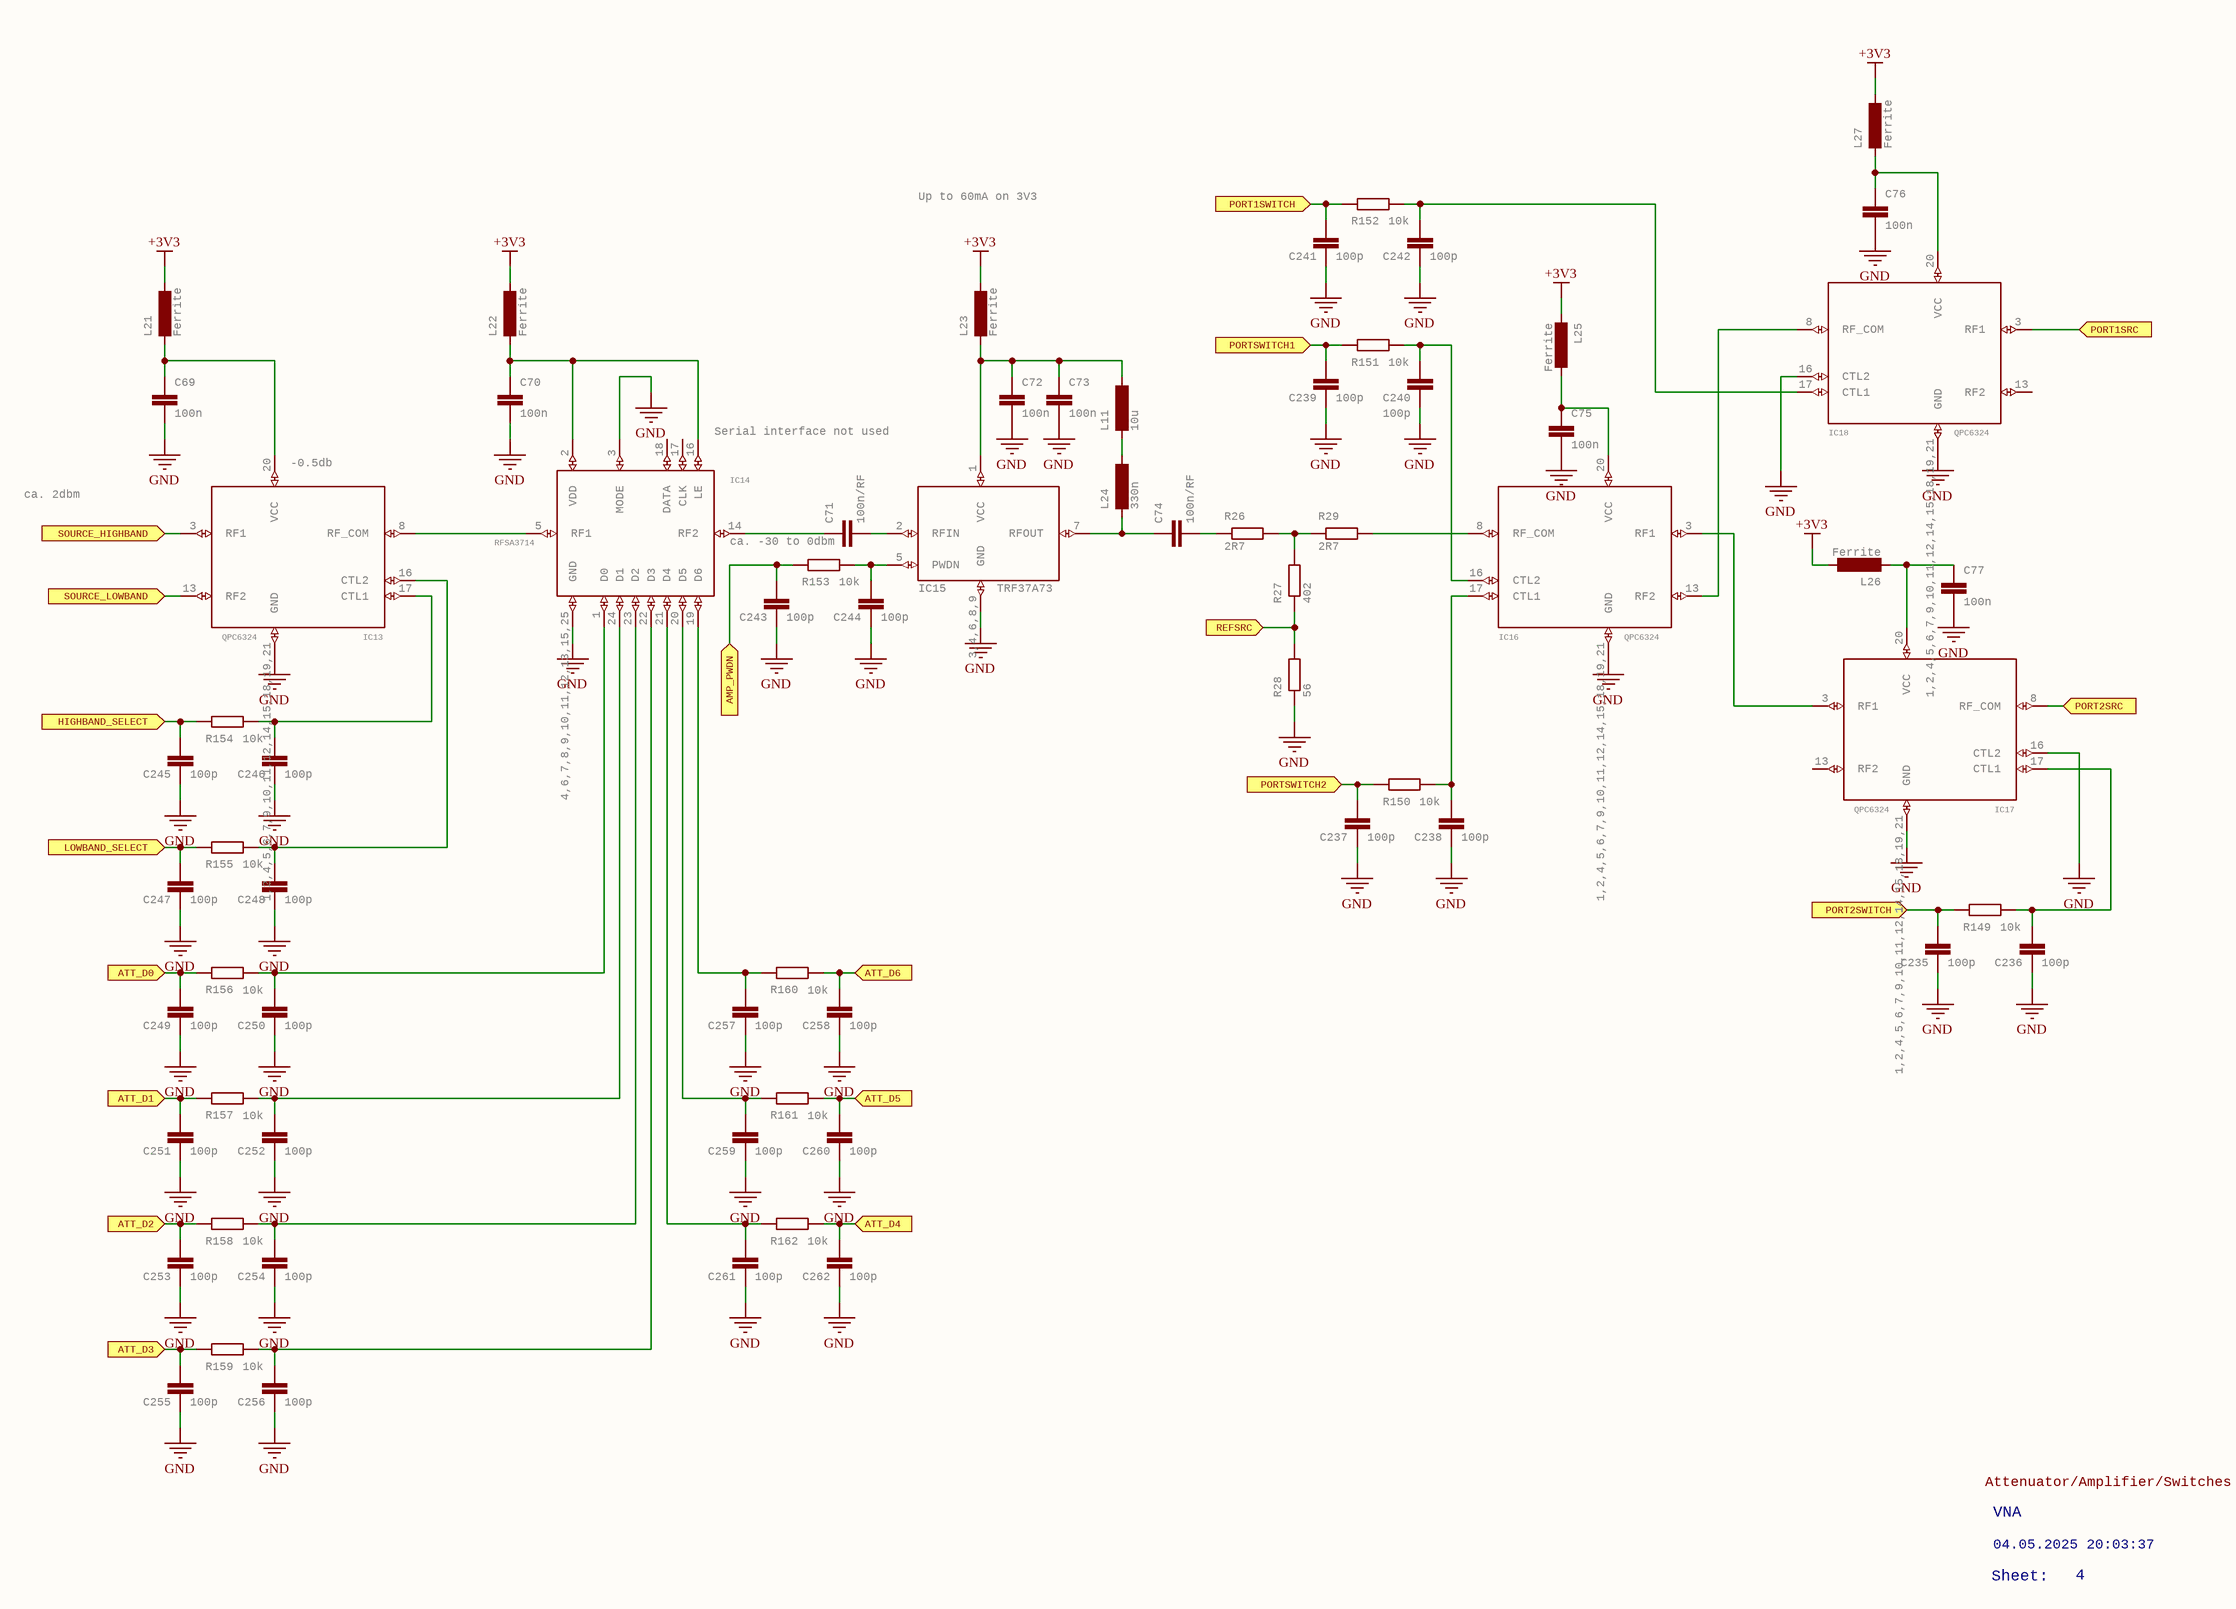
[diagram p3: VNA_3.SchDoc]

### Parts
C69  100n  [C0402]
C70  100n  [C0402]
C71  100n/RF  [C0402]
C72  100n  [C0402]
C73  100n  [C0402]
C74  100n/RF  [C0402]
C75  100n  [C0402]
C76  100n  [C0402]
C77  100n  [C0402]
C235  100p  [C0402]
C236  100p  [C0402]
C237  100p  [C0402]
C238  100p  [C0402]
C239  100p  [C0402]
C240  100p  [C0402]
C241  100p  [C0402]
C242  100p  [C0402]
C243  100p  [C0402]
C244  100p  [C0402]
C245  100p  [C0402]
C246  100p  [C0402]
C247  100p  [C0402]
C248  100p  [C0402]
C249  100p  [C0402]
C250  100p  [C0402]
C251  100p  [C0402]
C252  100p  [C0402]
C253  100p  [C0402]
C254  100p  [C0402]
C255  100p  [C0402]
C256  100p  [C0402]
C257  100p  [C0402]
C258  100p  [C0402]
C259  100p  [C0402]
C260  100p  [C0402]
C261  100p  [C0402]
C262  100p  [C0402]
IC13  QPC6324  [QFN50P400X400X75-21T206]
IC14  RFSA3714  [QFN50P400X400X75-25T270]
IC15  TRF37A73  [SON50P200X200X80-9T90X160N]
IC16  QPC6324  [QFN50P400X400X75-21T206]
IC17  QPC6324  [QFN50P400X400X75-21T206]
IC18  QPC6324  [QFN50P400X400X75-21T206]
L11  10u  [INDC2012X100N]
L21  Ferrite  [R0402]
L22  Ferrite  [R0402]
L23  Ferrite  [R0402]
L24  330n  [L0402]
L25  Ferrite  [R0402]
L26  Ferrite  [R0402]
L27  Ferrite  [R0402]
R26  2R7  [R0402]
R27  402  [R0402]
R28  56  [R0402]
R29  2R7  [R0402]
R149  10k  [R0402]
R150  10k  [R0402]
R151  10k  [R0402]
R152  10k  [R0402]
R153  10k  [R0402]
R154  10k  [R0402]
R155  10k  [R0402]
R156  10k  [R0402]
R157  10k  [R0402]
R158  10k  [R0402]
R159  10k  [R0402]
R160  10k  [R0402]
R161  10k  [R0402]
R162  10k  [R0402]

### Ports
AMP_PWDN (in), ATT_D0 (in), ATT_D1 (in), ATT_D2 (in), ATT_D3 (in), ATT_D4 (in), ATT_D5 (in), ATT_D6 (in), HIGHBAND_SELECT (in), LOWBAND_SELECT (in), PORT1SRC (in), PORT1SWITCH (in), PORT2SRC (in), PORT2SWITCH (in), PORTSWITCH1 (in), PORTSWITCH2 (in), REFSRC (in), SOURCE_HIGHBAND (in), SOURCE_LOWBAND (in)

### Nets
+3V3: L21.1 L22.1 L23.1 L25.2 L26.1 L27.1
GND: C69.2 C70.2 C72.2 C73.2 C75.2 C76.2 C77.2 C235.2 C236.1 C236.2 C237.2 C238.2 C239.2 C240.2 C241.2 C242.2 C243.2 C244.2 C245.2 C246.2 C247.2 C248.2 C249.2 C250.2 C251.2 C252.2 C253.2 C254.2 C255.2 C256.2 C257.2 C258.2 C259.2 C260.2 C261.2 C262.2 IC13.1,2,4,5,6,7,9,10,11,12,14,15,18,19,21(GND) IC14.3(MODE) IC14.4,6,7,8,9,10,11,12,13,15,25(GND) IC15.3,4,6,8,9(GND) IC16.1,2,4,5,6,7,9,10,11,12,14,15,18,19,21(GND) IC17.1,2,4,5,6,7,9,10,11,12,14,15,18,19,21(GND) IC17.16(CTL2) IC17.17(CTL1) IC18.1,2,4,5,6,7,9,10,11,12,14,15,18,19,21(GND) IC18.16(CTL2) R28.1 R149.1
NetC48_1: IC13.13(RF2) ; port SOURCE_LOWBAND
NetC68_2: IC13.3(RF1) ; port SOURCE_HIGHBAND
NetC69_1: C69.1 IC13.20(VCC) L21.2
NetC70_1: C70.1 IC14.2(VDD) IC14.16(LE) L22.2
NetC71_1: C71.1 IC14.14(RF2)
NetC71_2: C71.2 IC15.2(RFIN)
NetC72_1: C72.1 C73.1 IC15.1(VCC) L11.1 L23.2
NetC74_1: C74.1 IC15.7(RFOUT) L24.2
NetC74_2: C74.2 R26.1
NetC75_1: C75.1 IC16.20(VCC) L25.1
NetC76_1: C76.1 IC18.20(VCC) L27.2
NetC77_1: C77.1 IC17.20(VCC) L26.2
NetC96_1: IC18.3(RF1) ; port PORT1SRC
NetC133_1: IC17.8(RF_COM) ; port PORT2SRC
NetC170_1: R27.1 R28.2 ; port REFSRC
NetC235_1: C235.1 R149.2 ; port PORT2SWITCH
NetC237_1: C237.1 R150.2 ; port PORTSWITCH2
NetC238_1: C238.1 IC16.17(CTL1) R150.1
NetC239_1: C239.1 R151.2 ; port PORTSWITCH1
NetC240_1: C240.1 IC16.16(CTL2) R151.1
NetC241_1: C241.1 R152.2 ; port PORT1SWITCH
NetC242_1: C242.1 IC18.17(CTL1) R152.1
NetC243_1: C243.1 R153.2 ; port AMP_PWDN
NetC244_1: C244.1 IC15.5(PWDN) R153.1
NetC245_1: C245.1 R154.2 ; port HIGHBAND_SELECT
NetC246_1: C246.1 IC13.17(CTL1) R154.1
NetC247_1: C247.1 R155.2 ; port LOWBAND_SELECT
NetC248_1: C248.1 IC13.16(CTL2) R155.1
NetC249_1: C249.1 R156.2 ; port ATT_D0
NetC250_1: C250.1 IC14.1(D0) R156.1
NetC251_1: C251.1 R157.2 ; port ATT_D1
NetC252_1: C252.1 IC14.24(D1) R157.1
NetC253_1: C253.1 R158.2 ; port ATT_D2
NetC254_1: C254.1 IC14.23(D2) R158.1
NetC255_1: C255.1 R159.2 ; port ATT_D3
NetC256_1: C256.1 IC14.22(D3) R159.1
NetC257_1: C257.1 IC14.19(D6) R160.2
NetC258_1: C258.1 R160.1 ; port ATT_D6
NetC259_1: C259.1 IC14.20(D5) R161.2
NetC260_1: C260.1 R161.1 ; port ATT_D5
NetC261_1: C261.1 IC14.21(D4) R162.2
NetC262_1: C262.1 R162.1 ; port ATT_D4
NetIC13_8: IC13.8(RF_COM) IC14.5(RF1)
NetIC16_3: IC16.3(RF1) IC17.3(RF1)
NetIC16_8: IC16.8(RF_COM) R29.2
NetIC16_13: IC16.13(RF2) IC18.8(RF_COM)
NetL11_2: L11.2 L24.1
NetR26_2: R26.2 R27.2 R29.1

Not connected (* = marked no-connect by the designer): IC14 17(CLK) 18(DATA); IC17 13(RF2); IC18 13(RF2)

### Notes on the sheet
- Up to 60mA on 3V3
- (near IC14) Serial interface not used
- ca. 2dbm
- (near IC13) -0.5db
- ca. -30 to 0dbm
- Attenuator/Amplifier/Switches
- VNA
- Sheet:
- 04.05.2025 20:03:37
- 4

### Library data of the parts
C69-C77 C235-C262 = C-EU*?:2C0402: as C4 on sheet VNA_0; DeviceName: C0402; LibraryName: VNA; DeviceSetName: C-EU*?:2
IC13 IC16-IC18 = QPC6324: GateName_1: G$1; SymbolName_1: QPC6324; LibraryName: VNA; DeviceSetName: QPC6324
IC14 = RFSA3714: GateName_1: G$1; SymbolName_1: F1958; LibraryName: VNA; DeviceSetName: RFSA3714
IC15 = TRF37A73: GateName_1: G$1; SymbolName_1: AMPLIFIER_PWDN; LibraryName: VNA; DeviceSetName: TRF37A73
L11 = INDUCTOR: GateName_1: G$1; SymbolName_1: L-EU:1; LibraryName: VNA; DeviceSetName: INDUCTOR
L21-L23 L25-L27 = FERRITE: GateName_1: G$1; SymbolName_1: L-EU:1; LibraryName: VNA; DeviceSetName: FERRITE
L24 = INDUCTOR0402: as L14 on sheet VNA_1; LibraryName: VNA; DeviceSetName: INDUCTOR
R26-R29 R149-R162 = R-EU_R0402: as R1 on sheet VNA_0; DeviceName: R0402; LibraryName: VNA

## Sheet VNA_4.SchDoc: VNA
size 409 x 289 mm; Origin: Eagle; OriginPath: C:\Users\Ground Lab\Desktop\LibreVNA\Hardware\Eagle\VNA.sch; OriginSheet: 5; OriginDescription: 1. LO; Date: 04.05.2025 20:03:37; SheetNumber: 5; GateName_1: G$1; SymbolName_1: A3L-LOC; LibraryName: VNA; DeviceSetName: A3L-LOC; Sheet: Sheet:
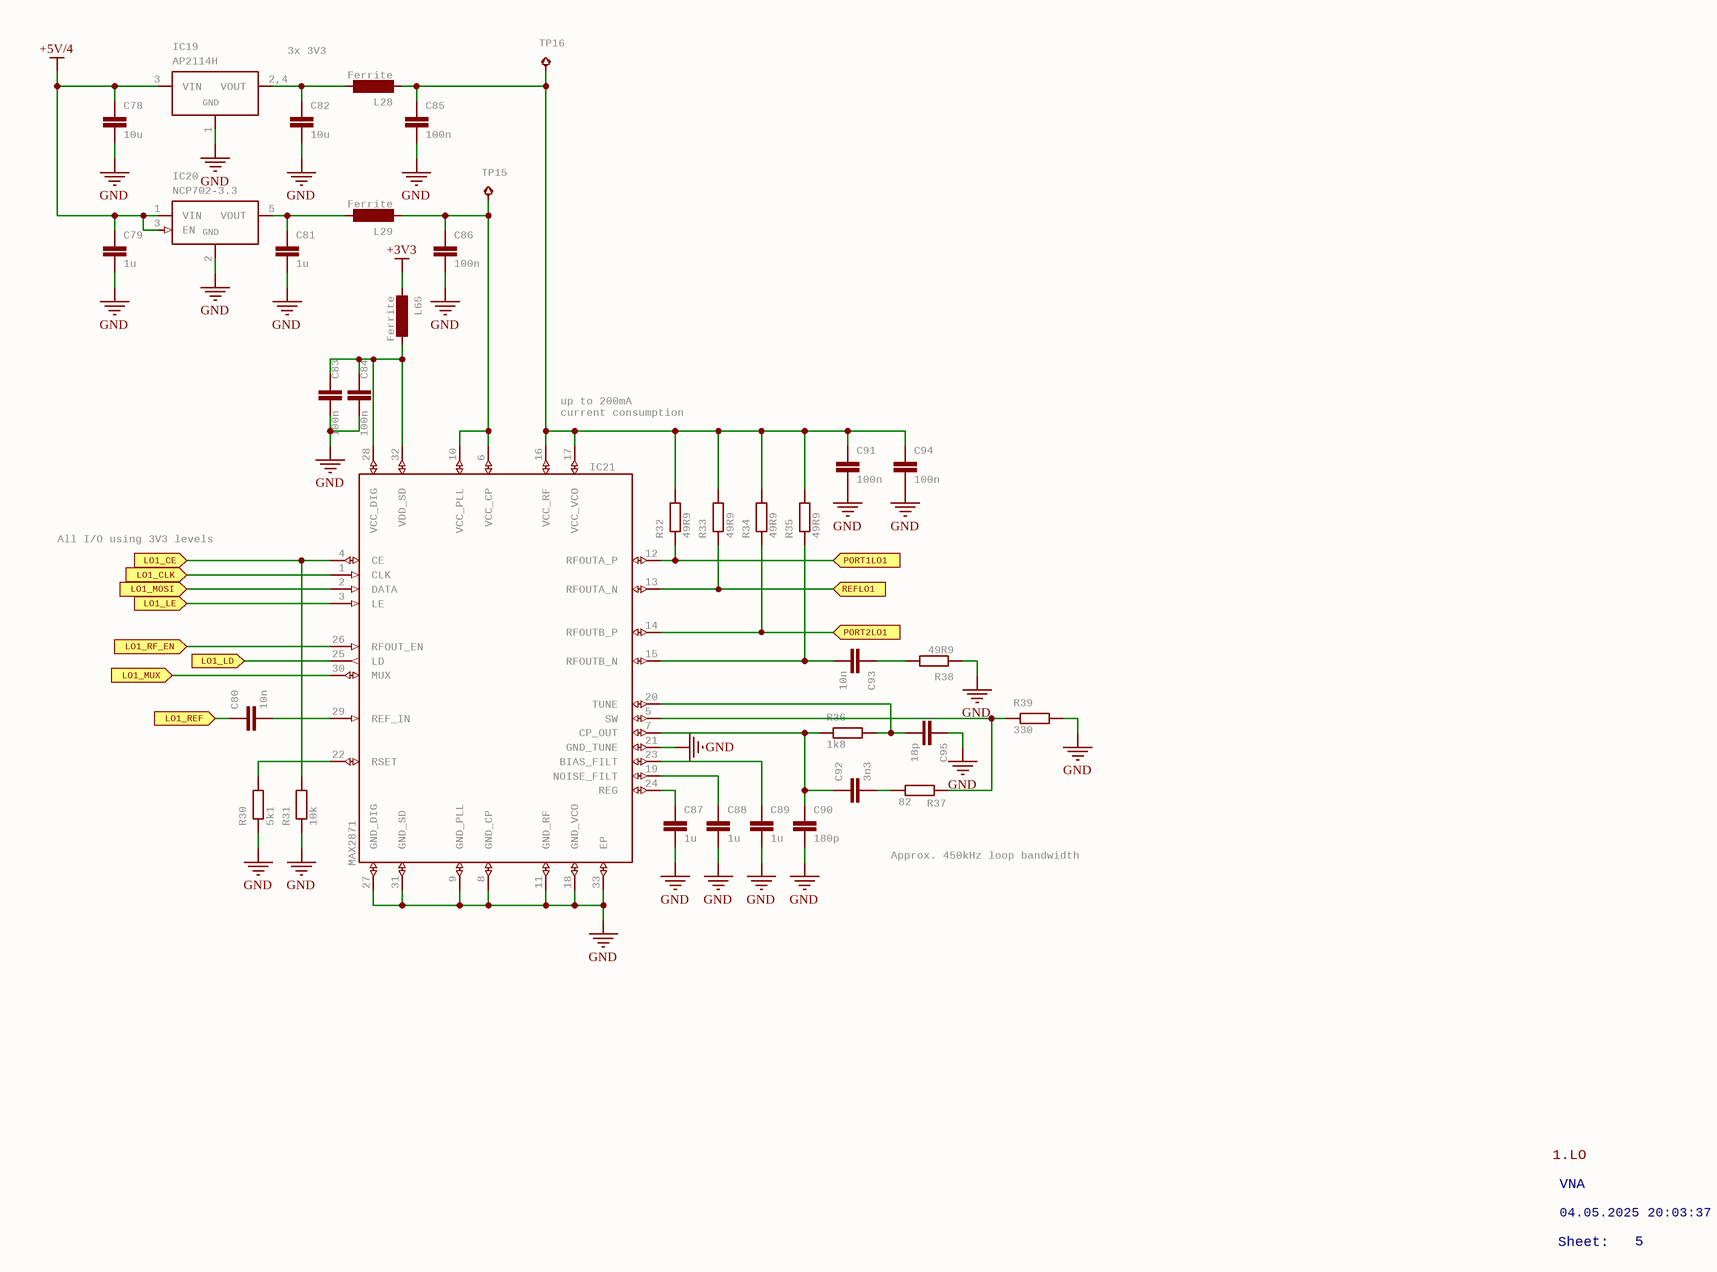
[diagram p4: VNA_4.SchDoc]

### Parts
C78  10u  [C1206]
C79  1u  [C0603]
C80  10n  [C0402]
C81  1u  [C0603]
C82  10u  [C1206]
C83  100n  [C0402]
C84  100n  [C0402]
C85  100n  [C0402]
C86  100n  [C0402]
C87  1u  [C0402]
C88  1u  [C0402]
C89  1u  [C0402]
C90  180p  [C0402]
C91  100n  [C0402]
C92  3n3  [C0402]
C93  10n  [C0402]
C94  100n  [C0402]
C95  18p  [C0402]
IC19  AP2114H  [SOT230P700X180-4]
IC20  NCP702-3.3  [SOT95P240X110-5]
IC21  MAX2871  [QFN50P500X500X80-33T310]
L28  Ferrite  [R0402]
L29  Ferrite  [R0402]
L65  Ferrite  [R0402]
R30  5k1  [R0402]
R31  10k  [R0402]
R32  49R9  [R0402]
R33  49R9  [R0402]
R34  49R9  [R0402]
R35  49R9  [R0402]
R36  1k8  [R0402]
R37  82  [R0402]
R38  49R9  [R0402]
R39  330  [R0402]
TP15  TPB1,27  [B1,27]  (value not drawn)
TP16  TPB1,27  [B1,27]  (value not drawn)

### Ports
LO1_CE (in), LO1_CLK (in), LO1_LD (in), LO1_LE (in), LO1_MOSI (in), LO1_MUX (in), LO1_REF (in), LO1_RF_EN (in), PORT1LO1 (in), PORT2LO1 (in), REFLO1 (in)

### Nets
+3V3: L65.2
+5V/4: C78.1 C79.1 IC19.3(VIN) IC20.1(VIN) IC20.3(EN)
GND: C78.2 C79.2 C81.2 C82.2 C83.2 C84.2 C85.2 C86.2 C87.2 C88.2 C89.2 C90.2 C91.2 C94.2 C95.1 IC19.1(GND) IC20.2(GND) IC21.8(GND_CP) IC21.9(GND_PLL) IC21.11(GND_RF) IC21.18(GND_VCO) IC21.21(GND_TUNE) IC21.27(GND_DIG) IC21.31(GND_SD) IC21.33(EP) R30.1 R31.1 R38.1 R39.2
NetC36_1: C80.1 ; port LO1_REF
NetC80_2: C80.2 IC21.4(CE) IC21.29(REF_IN) R31.2 ; port LO1_CE
NetC81_1: C81.1 IC20.5(VOUT) L29.1
NetC82_1: C82.1 IC19.2,4(VOUT) L28.1
NetC83_1: C83.1 C84.1 IC21.28(VCC_DIG) IC21.32(VDD_SD) L65.1
NetC85_1: C85.1 C91.1 C94.1 IC21.16(VCC_RF) IC21.17(VCC_VCO) L28.2 R32.2 R33.2 R34.2 R35.2 TP16.TP
NetC86_1: C86.1 IC21.6(VCC_CP) IC21.10(VCC_PLL) L29.2 TP15.TP
NetC87_1: C87.1 IC21.24(REG)
NetC88_1: C88.1 IC21.19(NOISE_FILT)
NetC89_1: C89.1 IC21.23(BIAS_FILT)
NetC90_1: C90.1 C92.1 IC21.7(CP_OUT) R36.1
NetC92_2: C92.2 R37.1
NetC93_1: C93.1 R38.2
NetC93_2: C93.2 IC21.15(RFOUTB_N) R35.1
NetC95_2: C95.2 IC21.20(TUNE) R36.2
NetC151_1: IC21.14(RFOUTB_P) R34.1 ; port PORT2LO1
NetC269_1: IC21.12(RFOUTA_P) R32.1 ; port PORT1LO1
NetC270_1: IC21.13(RFOUTA_N) R33.1 ; port REFLO1
NetIC21_1: IC21.1(CLK) ; port LO1_CLK
NetIC21_2: IC21.2(DATA) ; port LO1_MOSI
NetIC21_3: IC21.3(LE) ; port LO1_LE
NetIC21_5: IC21.5(SW) R37.2 R39.1
NetIC21_22: IC21.22(RSET) R30.2
NetIC21_25: IC21.25(LD) ; port LO1_LD
NetIC21_26: IC21.26(RFOUT_EN) ; port LO1_RF_EN
NetIC21_30: IC21.30(MUX) ; port LO1_MUX

### Notes on the sheet
- 3x 3V3
- up to 200mA
  current consumption
- All I/O using 3V3 levels
- Approx. 450kHz loop bandwidth
- 1.LO
- VNA
- Sheet:
- 04.05.2025 20:03:37
- 5

### Library data of the parts
C78 C82 = C-EUC1206: as C1 on sheet VNA_0; DeviceName: C1206; LibraryName: VNA; DeviceSetName: C-EU
C79 C81 = C-EU*?:1C0603: as C18 on sheet VNA_0; DeviceName: C0603; LibraryName: VNA; DeviceSetName: C-EU*?:1
C80 C83-C95 = C-EU*?:2C0402: as C4 on sheet VNA_0; DeviceName: C0402; LibraryName: VNA; DeviceSetName: C-EU*?:2
IC19 = AP2114H: as IC8 on sheet VNA_2; LibraryName: VNA; GND: GND
IC20 = NCP702: GateName_1: G$1; SymbolName_1: VREG_EN; LibraryName: VNA; DeviceSetName: NCP702; GND: GND
IC21 = MAX2871: GateName_1: G$1; SymbolName_1: MAX2871; LibraryName: VNA; DeviceSetName: MAX2871
L28 L29 L65 = FERRITE: GateName_1: G$1; SymbolName_1: L-EU:1; LibraryName: VNA; DeviceSetName: FERRITE
R30-R39 = R-EU_R0402: as R1 on sheet VNA_0; DeviceName: R0402; LibraryName: VNA
TP15 TP16 = TPB1,27: as TP1 on sheet VNA_0; DeviceName: B1,27; LibraryName: VNA; DeviceSetName: TP

## Sheet VNA_5.SchDoc: VNA
size 409 x 289 mm; Origin: Eagle; OriginPath: C:\Users\Ground Lab\Desktop\LibreVNA\Hardware\Eagle\VNA.sch; OriginSheet: 6; OriginDescription: Port 1; Date: 04.05.2025 20:03:37; SheetNumber: 6; GateName_1: G$1; SymbolName_1: A3L-LOC; LibraryName: VNA; DeviceSetName: A3L-LOC; Sheet: Sheet:
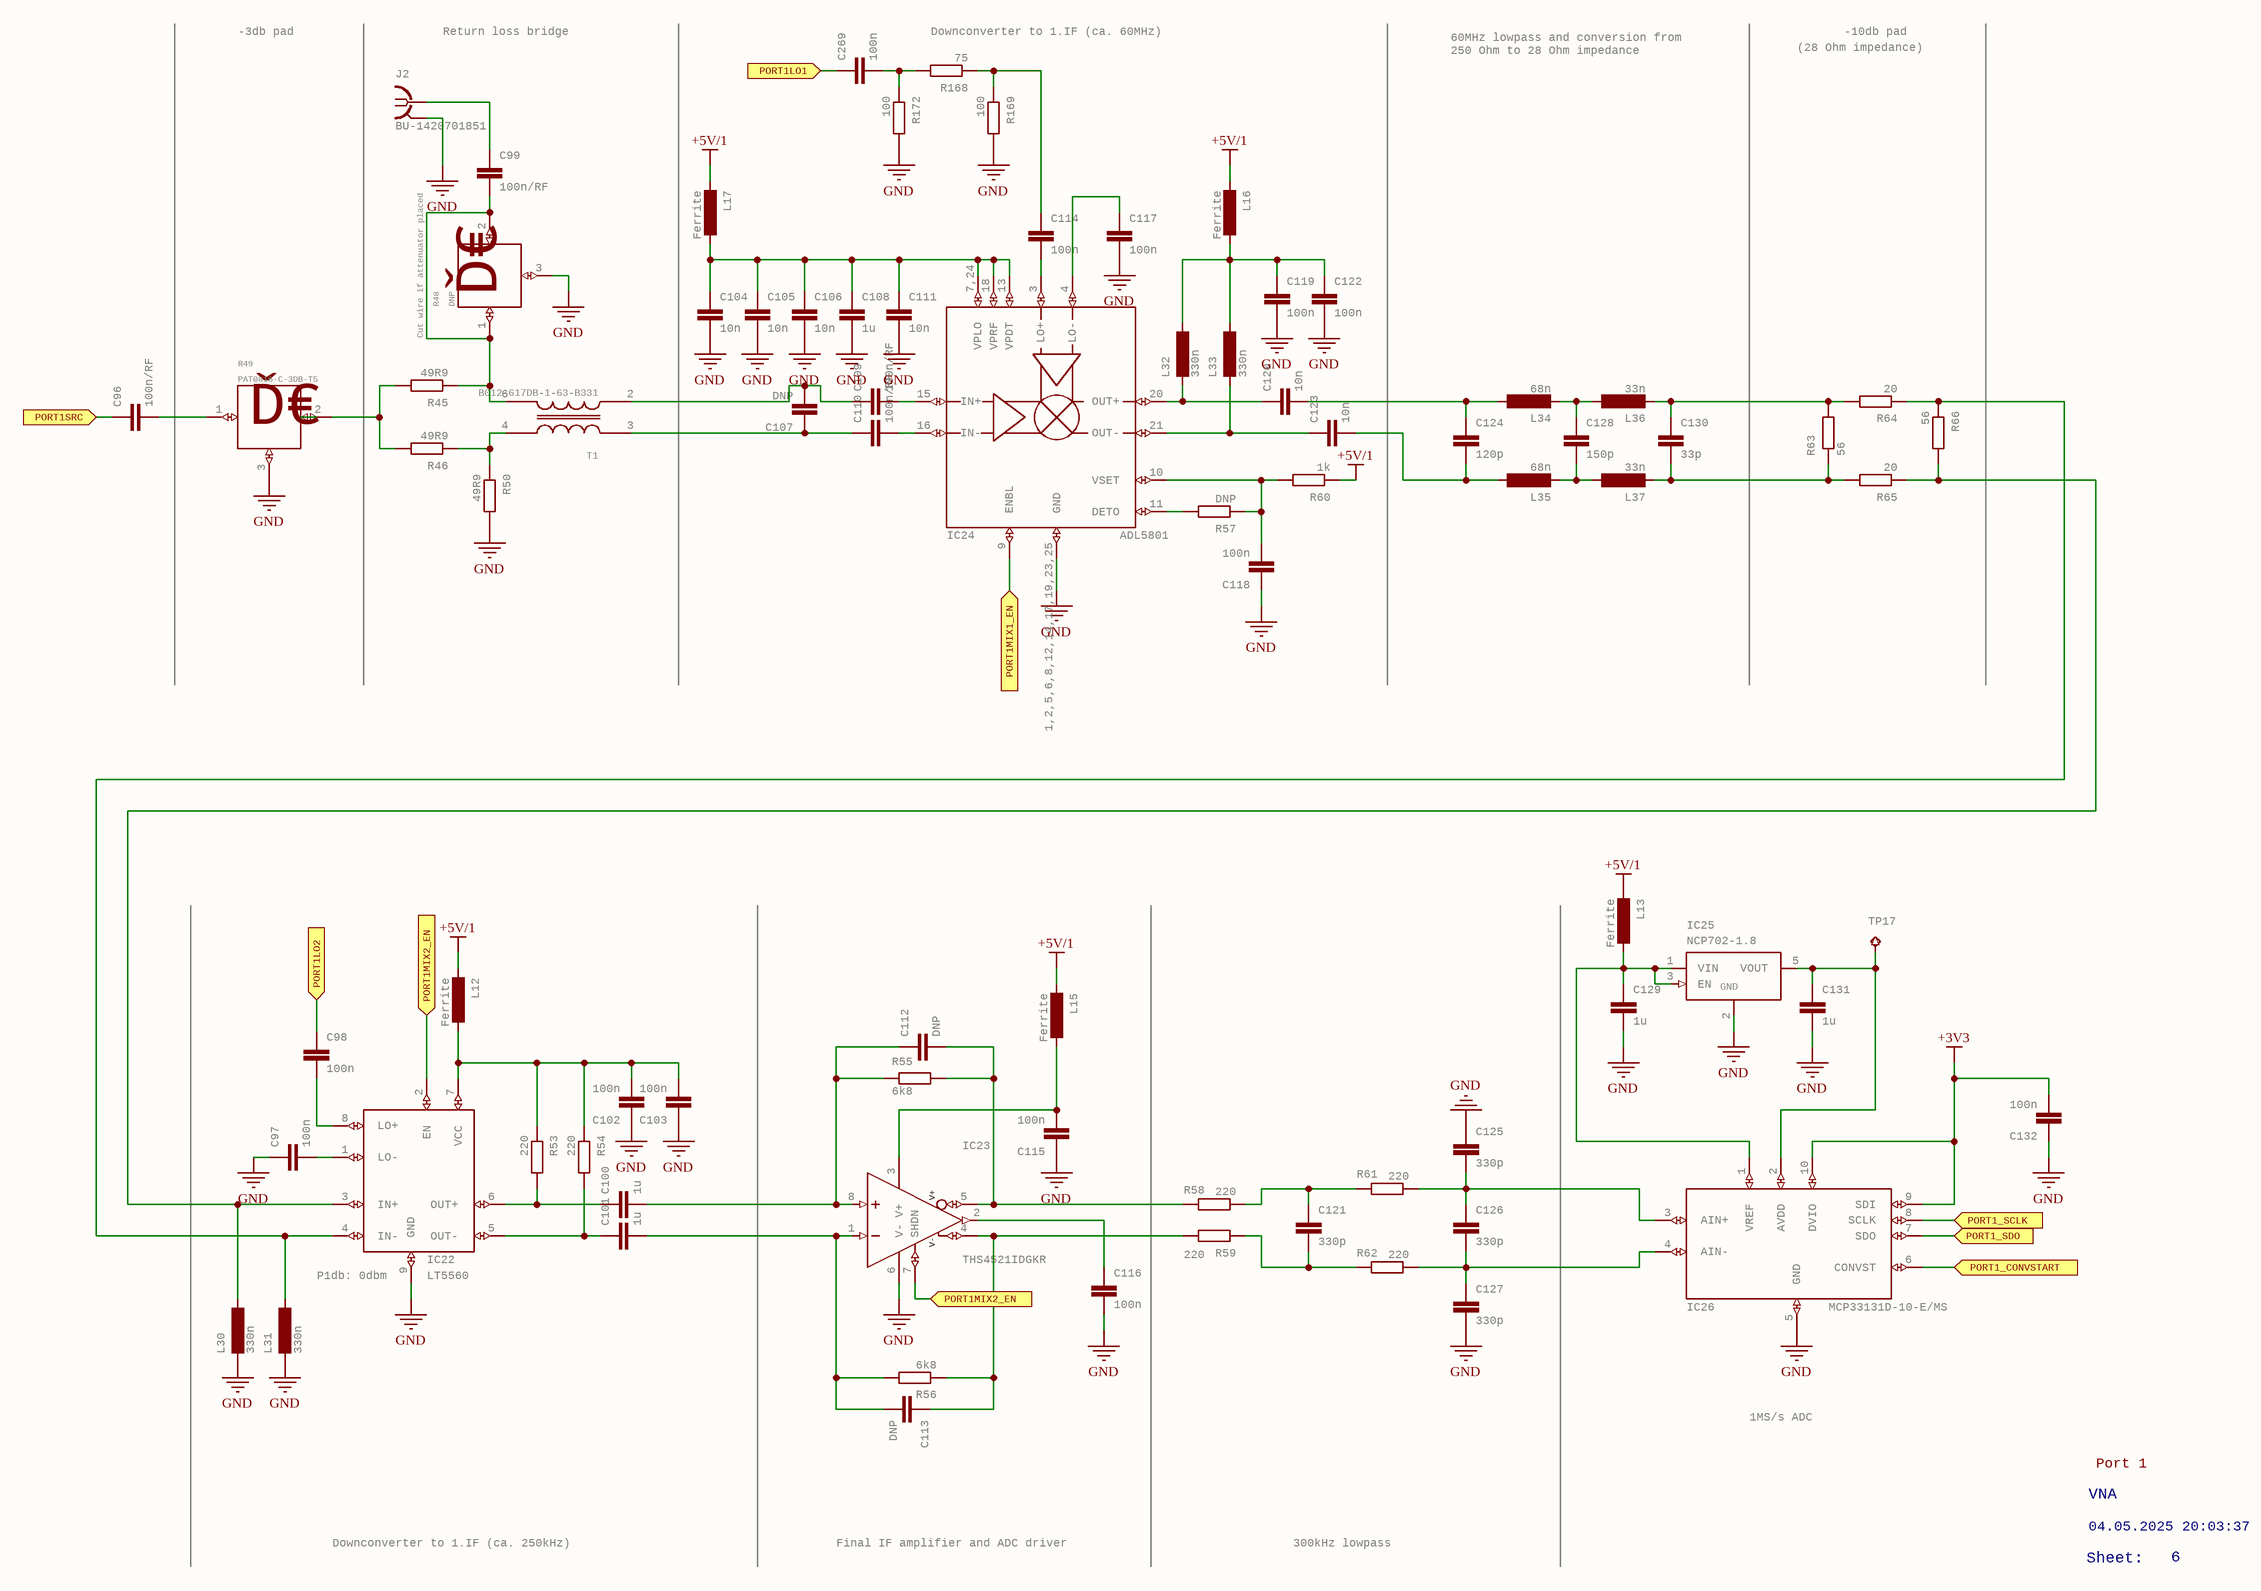
[diagram p5: VNA_5.SchDoc]

### Parts
C96  100n/RF  [C0402]
C97  100n  [C0402]
C98  100n  [C0402]
C99  100n/RF  [C0402]
C100  1u  [C0402]
C101  1u  [C0402]
C102  100n  [C0402]
C103  100n  [C0402]
C104  10n  [C0402]
C105  10n  [C0402]
C106  10n  [C0402]
C107  DNP  [C0402]
C108  1u  [C0402]
C109  100n/RF  [C0402]
C110  100n/RF  [C0402]
C111  10n  [C0402]
C112  DNP  [C0402]
C113  DNP  [C0402]
C114  100n  [C0402]
C115  100n  [C0402]
C116  100n  [C0402]
C117  100n  [C0402]
C118  100n  [C0402]
C119  100n  [C0402]
C120  10n  [C0402]
C121  330p  [C0402]
C122  100n  [C0402]
C123  10n  [C0402]
C124  120p  [C0402]
C125  330p  [C0402]
C126  330p  [C0402]
C127  330p  [C0402]
C128  150p  [C0402]
C129  1u  [C0402]
C130  33p  [C0402]
C131  1u  [C0402]
C132  100n  [C0402]
C269  100n  [C0402]
IC22  LT5560  [SON50P300X300X80-9T165X238]
IC23  THS4521IDGKR  [SOP65P490X110-8N]
IC24  ADL5801  [QFN50P400X400X100-25T250N]
IC25  NCP702-1.8  [SOT95P240X110-5]
IC26  MCP33131D-10-E/MS  [SOP50P490X110-10N]
J2  BU-1420701851  [BU-1420701851]
L12  Ferrite  [R0402]
L13  Ferrite  [R0402]
L15  Ferrite  [R0402]
L16  Ferrite  [R0402]
L17  Ferrite  [R0402]
L30  330n  [L0402]
L31  330n  [L0402]
L32  330n  [L0402]
L33  330n  [L0402]
L34  68n  [L0402]
L35  68n  [L0402]
L36  33n  [L0402]
L37  33n  [L0402]
R45  49R9  [R0402]
R46  49R9  [R0402]
R48  DNP  [PAT0816]
R49  PAT0816-C-3DB-T5  [PAT0816]
R50  49R9  [R0402]
R53  220  [R0402]
R54  220  [R0402]
R55  6k8  [R0402]
R56  6k8  [R0402]
R57  DNP  [R0402]
R58  220  [R0402]
R59  220  [R0402]
R60  1k  [R0402]
R61  220  [R0402]
R62  220  [R0402]
R63  56  [R0402]
R64  20  [R0402]
R65  20  [R0402]
R66  56  [R0402]
R168  75  [R0402]
R169  100  [R0402]
R172  100  [R0402]
T1  B012-617DB-1-63-B331  [EASTEVER_BALUN]
TP17  TPB1,27  [B1,27]  (value not drawn)

### Ports
PORT1_CONVSTART (in), PORT1_SCLK (in), PORT1_SDO (in), PORT1LO1 (in), PORT1LO2 (in), PORT1MIX1_EN (in), PORT1MIX2_EN (in), PORT1SRC (in)

### Nets
+3V3: C132.2 IC26.9(SDI) IC26.10(DVIO)
+5V/1: L12.2 L13.2 L15.2 L16.2 L17.2 R60.1
GND: C97.1 C102.1 C103.1 C104.2 C105.2 C106.2 C108.2 C111.2 C115.1 C116.2 C117.2 C118.1 C119.2 C122.2 C125.1 C127.2 C129.2 C131.2 C132.1 IC22.9(GND) IC23.6(V-) IC24.1,2,5,6,8,12,14,17,19,23,25(GND) IC25.2(GND) IC26.5(GND) J2.G@1-4 L30.2 L31.2 R48.3(GND) R49.3(GND) R50.2 R169.2 R172.2
NetC46_1: C98.1 ; port PORT1LO2
NetC96_1: C96.1 ; port PORT1SRC
NetC96_2: C96.2 R49.1(IN)
NetC97_2: C97.2 IC22.1(LO-)
NetC98_2: C98.2 IC22.8(LO+)
NetC99_1: C99.1 J2.1
NetC99_2: C99.2 R45.1 R48.1(IN) R48.2(OUT) T1.6(OUT-)
NetC100_1: C100.1 IC22.6(OUT+) R53.2
NetC100_2: C100.2 C112.1 IC23.8(+IN) R55.1
NetC101_1: C101.1 IC22.5(OUT-) R54.2
NetC101_2: C101.2 C113.2 IC23.1(-IN) R56.2
NetC102_2: C102.2 C103.2 IC22.7(VCC) L12.1 R53.1 R54.1
NetC104_1: C104.1 C105.1 C106.1 C108.1 C111.1 IC24.7,24(VPLO) IC24.13(VPDT) IC24.18(VPRF) L17.1
NetC107_1: C107.1 C110.1 T1.3(IN+)
NetC107_2: C107.2 C109.1 T1.2(IN-)
NetC109_2: C109.2 IC24.15(IN+)
NetC110_2: C110.2 IC24.16(IN-)
NetC112_2: C112.2 IC23.5(-OUT) R55.2 R58.2
NetC113_1: C113.1 IC23.4(+OUT) R56.1 R59.2
NetC114_1: C114.1 R168.1 R169.1
NetC114_2: C114.2 IC24.3(LO+)
NetC115_2: C115.2 IC23.3(V+) L15.1
NetC116_1: C116.1 IC23.2(VOCM)
NetC117_1: C117.1 IC24.4(LO-)
NetC118_2: C118.2 IC24.10(VSET) R57.1 R60.2
NetC119_1: C119.1 C122.1 L16.1 L32.1 L33.1
NetC120_1: C120.1 IC24.20(OUT+) L32.2
NetC120_2: C120.2 C124.1 L34.1
NetC121_1: C121.1 R58.1 R61.2
NetC121_2: C121.2 R59.1 R62.2
NetC123_1: C123.1 IC24.21(OUT-) L33.2
NetC123_2: C123.2 C124.2 L35.1
NetC125_2: C125.2 C126.1 IC26.3(AIN+) R61.1
NetC126_2: C126.2 C127.1 IC26.4(AIN-) R62.1
NetC128_1: C128.1 L34.2 L36.1
NetC128_2: C128.2 L35.2 L37.1
NetC129_1: C129.1 IC25.1(VIN) IC25.3(EN) IC26.1(VREF) L13.1
NetC130_1: C130.1 L36.2 R63.2 R64.2
NetC130_2: C130.2 L37.2 R63.1 R65.2
NetC131_1: C131.1 IC25.5(VOUT) IC26.2(AVDD) TP17.TP
NetC228_1: IC22.2(EN) IC23.7(SHDN) ; port PORT1MIX2_EN
NetC230_1: IC24.9(ENBL) ; port PORT1MIX1_EN
NetC269_1: C269.1 ; port PORT1LO1
NetC269_2: C269.2 R168.2 R172.1
NetIC22_3: IC22.3(IN+) L30.1 R65.1 R66.2
NetIC22_4: IC22.4(IN-) L31.1 R64.1 R66.1
NetIC24_11: IC24.11(DETO) R57.2
NetIC26_6: IC26.6(CONVST) ; port PORT1_CONVSTART
NetIC26_7: IC26.7(SDO) ; port PORT1_SDO
NetIC26_8: IC26.8(SCLK) ; port PORT1_SCLK
NetR45_2: R45.2 R46.2 R49.2(OUT)
NetR46_1: R46.1 R50.1 T1.4(OUT+)

### Notes on the sheet
- -3db pad
- Return loss bridge
- (near R168) Downconverter to 1.IF (ca. 60MHz)
- 60MHz lowpass and conversion from
  250 Ohm to 28 Ohm impedance
- (28 Ohm impedance)
- -10db pad
- Cut wire if attenuator placed
- (near IC22) P1db: 0dbm
- 1MS/s ADC
- VNA
- Port 1
- Downconverter to 1.IF (ca. 250kHz)
- Final IF amplifier and ADC driver
- 300kHz lowpass
- Sheet:
- 04.05.2025 20:03:37
- 6

### Library data of the parts
C96-C132 C269 = C-EU*?:2C0402: as C4 on sheet VNA_0; DeviceName: C0402; LibraryName: VNA; DeviceSetName: C-EU*?:2
IC22 = LT5560: GateName_1: G$1; SymbolName_1: LT5560; LibraryName: VNA; DeviceSetName: LT5560
IC23 = THS4521IDGKR: GateName_1: G$1; SymbolName_1: OPAMPDIFF_SHDN; LibraryName: VNA; DeviceSetName: THS4521IDGKR; V+: V+; V-: V-
IC24 = ADL5801: GateName_1: G$1; SymbolName_1: ADL5801; LibraryName: VNA; DeviceSetName: ADL5801
IC25 = NCP702: GateName_1: G$1; SymbolName_1: VREG_EN; LibraryName: VNA; DeviceSetName: NCP702; GND: GND
IC26 = MCP33131D-10-E/MS: GateName_1: G$1; SymbolName_1: MCP33131D-10-E/MS; LibraryName: VNA; DeviceSetName: MCP33131D-10-E/MS
J2 = BU-1420701851: GateName_1: G$1; SymbolName_1: BNC-FGND; LibraryName: VNA; DeviceSetName: BU-1420701851
L12 L13 L15-L17 = FERRITE: GateName_1: G$1; SymbolName_1: L-EU:1; LibraryName: VNA; DeviceSetName: FERRITE
L30-L37 = INDUCTOR0402: as L14 on sheet VNA_1; LibraryName: VNA; DeviceSetName: INDUCTOR
R45 R46 R50 R53-R66 R168 R169 R172 = R-EU_R0402: as R1 on sheet VNA_0; DeviceName: R0402; LibraryName: VNA
R48 R49 = PAT0816-C-3DB-T5: 3dB pad attenuator; GateName_1: G$1; SymbolName_1: ATTENUATOR_3PIN; LibraryName: VNA; DeviceSetName: PAT0816-C-3DB-T5; Ď€: Ď€
T1 = B012-617DB-1-63-B331: GateName_1: G$1; SymbolName_1: BALUN_1:1; LibraryName: VNA; DeviceSetName: B012-617DB-1-63-B331
TP17 = TPB1,27: as TP1 on sheet VNA_0; DeviceName: B1,27; LibraryName: VNA; DeviceSetName: TP

## Sheet VNA_6.SchDoc: VNA
size 409 x 289 mm; Origin: Eagle; OriginPath: C:\Users\Ground Lab\Desktop\LibreVNA\Hardware\Eagle\VNA.sch; OriginSheet: 7; OriginDescription: Port 2; Date: 04.05.2025 20:03:37; SheetNumber: 7; GateName_1: G$1; SymbolName_1: A3L-LOC; LibraryName: VNA; DeviceSetName: A3L-LOC; Sheet: Sheet:
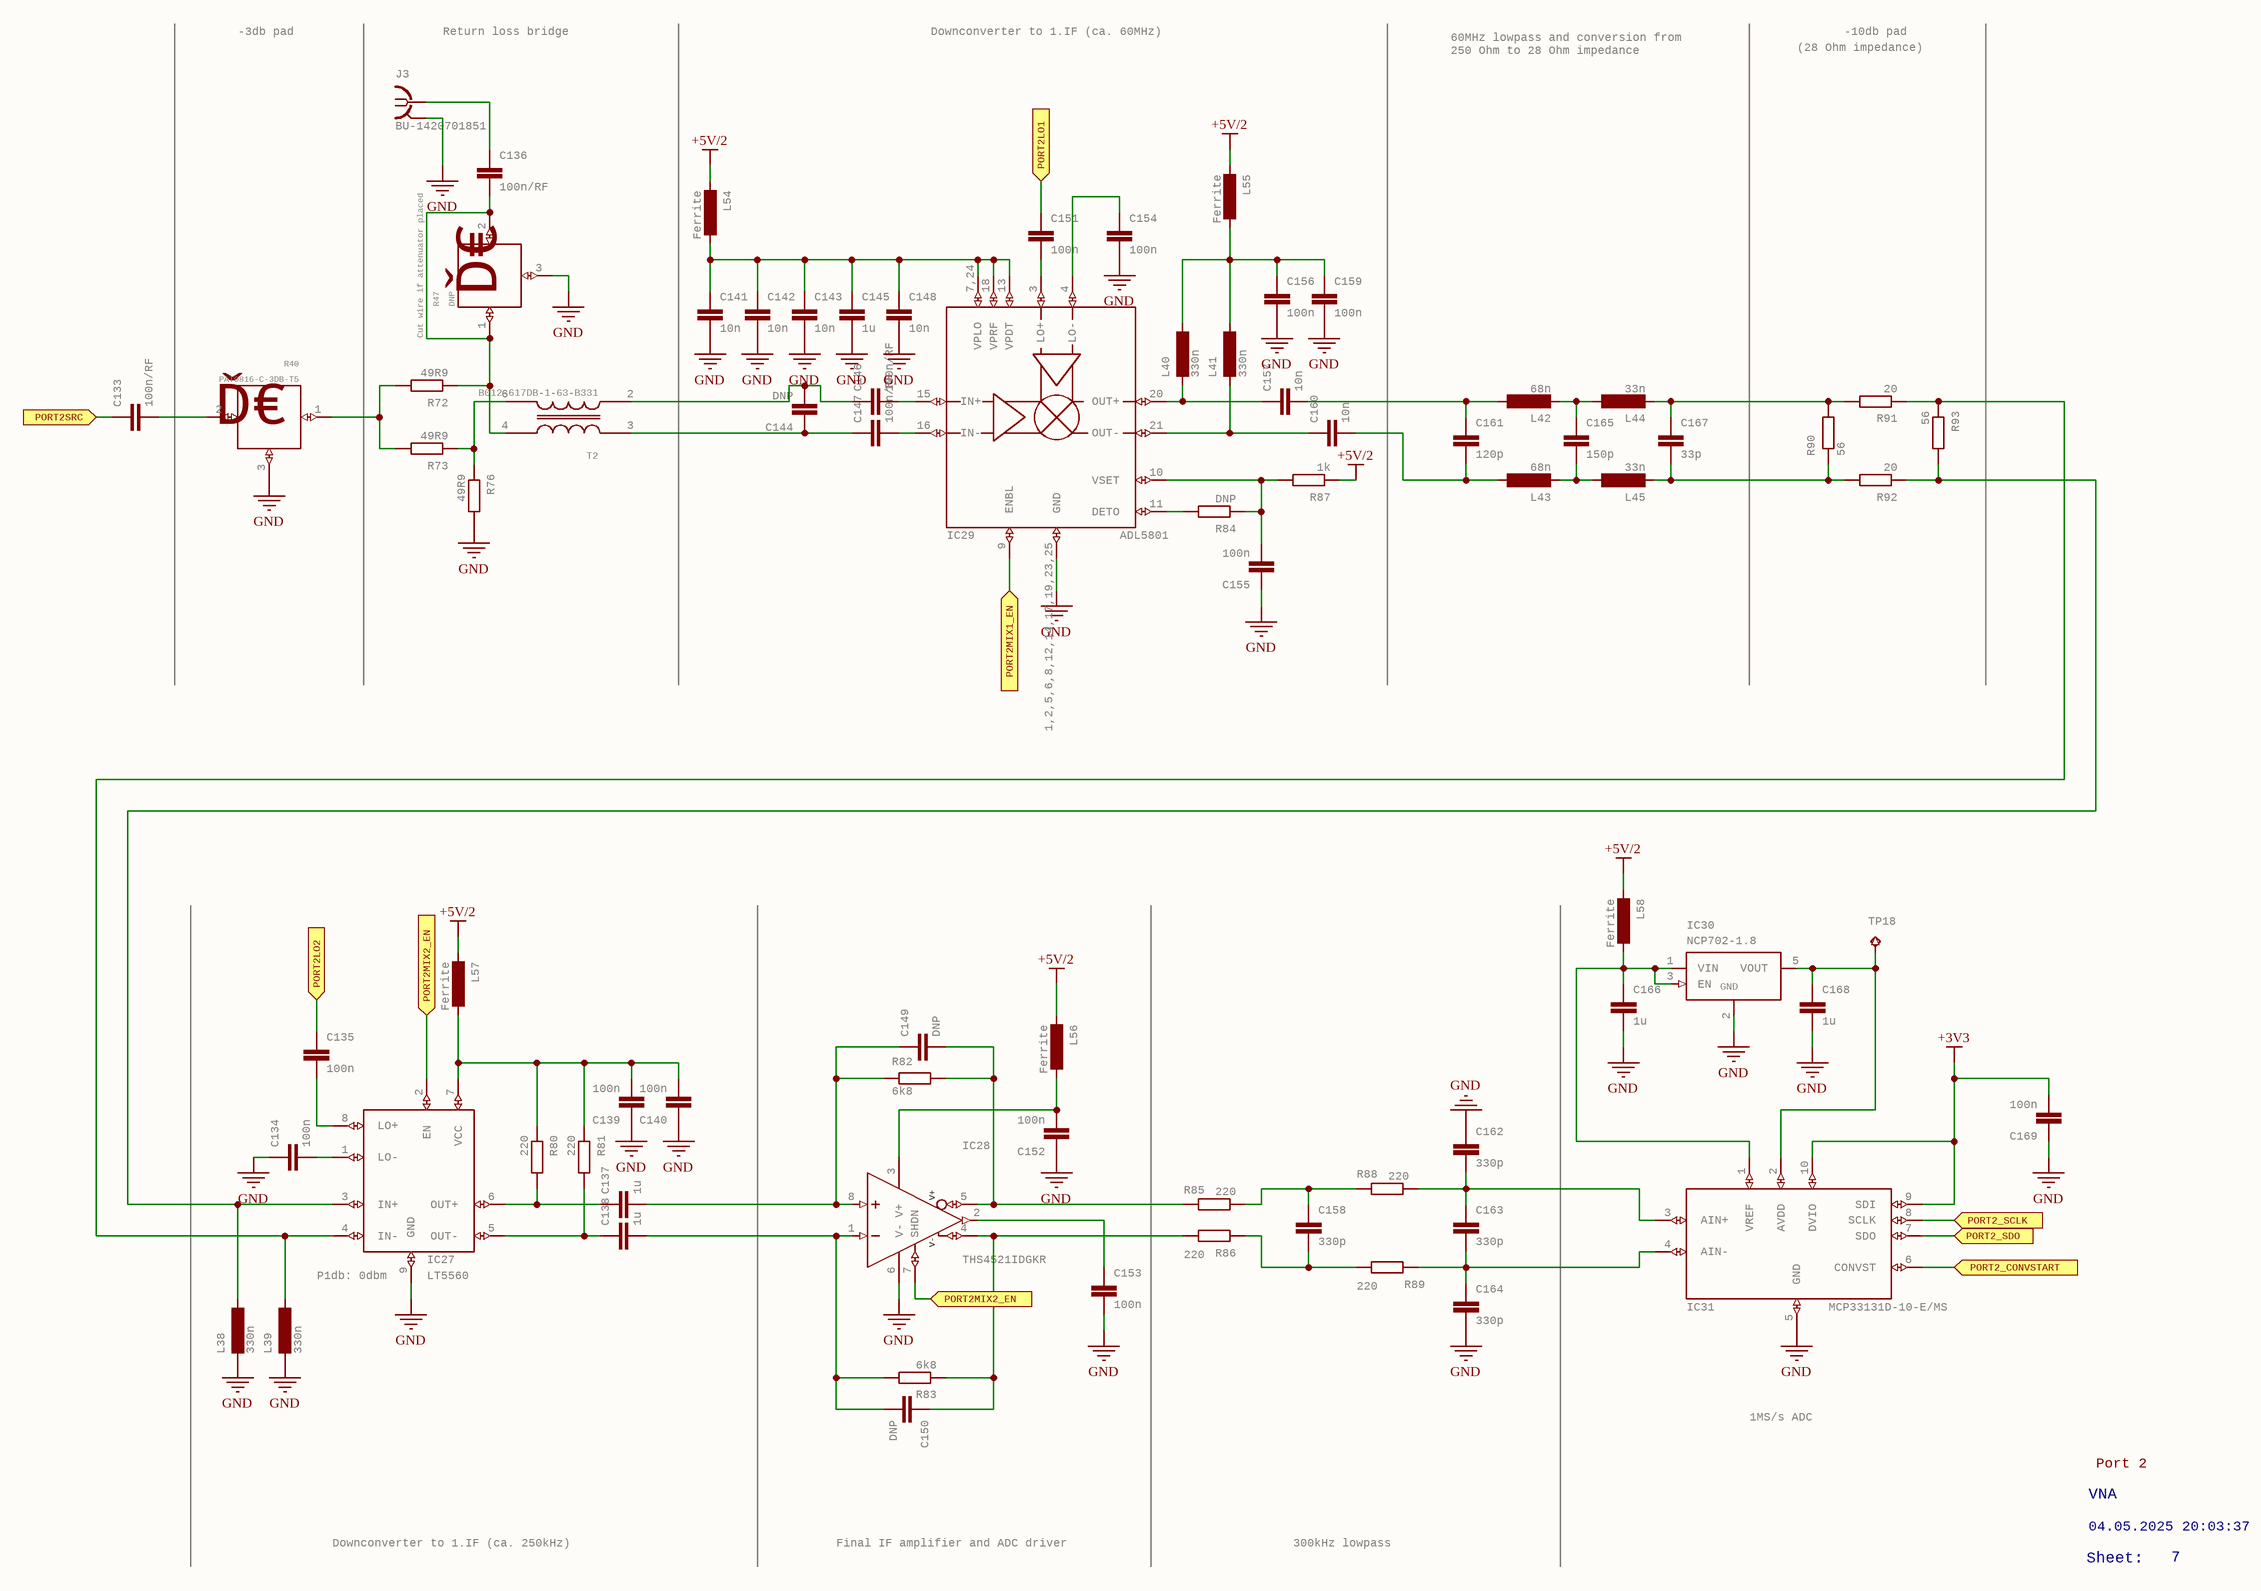
[diagram p6: VNA_6.SchDoc]

### Parts
C133  100n/RF  [C0402]
C134  100n  [C0402]
C135  100n  [C0402]
C136  100n/RF  [C0402]
C137  1u  [C0402]
C138  1u  [C0402]
C139  100n  [C0402]
C140  100n  [C0402]
C141  10n  [C0402]
C142  10n  [C0402]
C143  10n  [C0402]
C144  DNP  [C0402]
C145  1u  [C0402]
C146  100n/RF  [C0402]
C147  100n/RF  [C0402]
C148  10n  [C0402]
C149  DNP  [C0402]
C150  DNP  [C0402]
C151  100n  [C0402]
C152  100n  [C0402]
C153  100n  [C0402]
C154  100n  [C0402]
C155  100n  [C0402]
C156  100n  [C0402]
C157  10n  [C0402]
C158  330p  [C0402]
C159  100n  [C0402]
C160  10n  [C0402]
C161  120p  [C0402]
C162  330p  [C0402]
C163  330p  [C0402]
C164  330p  [C0402]
C165  150p  [C0402]
C166  1u  [C0402]
C167  33p  [C0402]
C168  1u  [C0402]
C169  100n  [C0402]
IC27  LT5560  [SON50P300X300X80-9T165X238]
IC28  THS4521IDGKR  [SOP65P490X110-8N]
IC29  ADL5801  [QFN50P400X400X100-25T250N]
IC30  NCP702-1.8  [SOT95P240X110-5]
IC31  MCP33131D-10-E/MS  [SOP50P490X110-10N]
J3  BU-1420701851  [BU-1420701851]
L38  330n  [L0402]
L39  330n  [L0402]
L40  330n  [L0402]
L41  330n  [L0402]
L42  68n  [L0402]
L43  68n  [L0402]
L44  33n  [L0402]
L45  33n  [L0402]
L54  Ferrite  [R0402]
L55  Ferrite  [R0402]
L56  Ferrite  [R0402]
L57  Ferrite  [R0402]
L58  Ferrite  [R0402]
R40  PAT0816-C-3DB-T5  [PAT0816]
R47  DNP  [PAT0816]
R72  49R9  [R0402]
R73  49R9  [R0402]
R76  49R9  [R0402]
R80  220  [R0402]
R81  220  [R0402]
R82  6k8  [R0402]
R83  6k8  [R0402]
R84  DNP  [R0402]
R85  220  [R0402]
R86  220  [R0402]
R87  1k  [R0402]
R88  220  [R0402]
R89  220  [R0402]
R90  56  [R0402]
R91  20  [R0402]
R92  20  [R0402]
R93  56  [R0402]
T2  B012-617DB-1-63-B331  [EASTEVER_BALUN]
TP18  TPB1,27  [B1,27]  (value not drawn)

### Ports
PORT2_CONVSTART (in), PORT2_SCLK (in), PORT2_SDO (in), PORT2LO1 (in), PORT2LO2 (in), PORT2MIX1_EN (in), PORT2MIX2_EN (in), PORT2SRC (in)

### Nets
+3V3: C169.2 IC31.9(SDI) IC31.10(DVIO)
+5V/2: L54.2 L55.2 L56.2 L57.2 L58.2 R87.1
GND: C134.1 C139.1 C140.1 C141.2 C142.2 C143.2 C145.2 C148.2 C152.1 C153.2 C154.2 C155.1 C156.2 C159.2 C162.1 C164.2 C166.2 C168.2 C169.1 IC27.9(GND) IC28.6(V-) IC29.1,2,5,6,8,12,14,17,19,23,25(GND) IC30.2(GND) IC31.5(GND) J3.G@1-4 L38.2 L39.2 R40.3(GND) R47.3(GND) R76.2
NetC44_1: C135.1 ; port PORT2LO2
NetC133_1: C133.1 ; port PORT2SRC
NetC133_2: C133.2 R40.2(OUT)
NetC134_2: C134.2 IC27.1(LO-)
NetC135_2: C135.2 IC27.8(LO+)
NetC136_1: C136.1 J3.1
NetC136_2: C136.2 R47.1(IN) R47.2(OUT) R72.1 T2.4(OUT+)
NetC137_1: C137.1 IC27.6(OUT+) R80.2
NetC137_2: C137.2 C149.1 IC28.8(+IN) R82.1
NetC138_1: C138.1 IC27.5(OUT-) R81.2
NetC138_2: C138.2 C150.2 IC28.1(-IN) R83.2
NetC139_2: C139.2 C140.2 IC27.7(VCC) L57.1 R80.1 R81.1
NetC141_1: C141.1 C142.1 C143.1 C145.1 C148.1 IC29.7,24(VPLO) IC29.13(VPDT) IC29.18(VPRF) L54.1
NetC144_1: C144.1 C147.1 T2.3(IN+)
NetC144_2: C144.2 C146.1 T2.2(IN-)
NetC146_2: C146.2 IC29.15(IN+)
NetC147_2: C147.2 IC29.16(IN-)
NetC149_2: C149.2 IC28.5(-OUT) R82.2 R85.2
NetC150_1: C150.1 IC28.4(+OUT) R83.1 R86.2
NetC151_1: C151.1 ; port PORT2LO1
NetC151_2: C151.2 IC29.3(LO+)
NetC152_2: C152.2 IC28.3(V+) L56.1
NetC153_1: C153.1 IC28.2(VOCM)
NetC154_1: C154.1 IC29.4(LO-)
NetC155_2: C155.2 IC29.10(VSET) R84.1 R87.2
NetC156_1: C156.1 C159.1 L40.1 L41.1 L55.1
NetC157_1: C157.1 IC29.20(OUT+) L40.2
NetC157_2: C157.2 C161.1 L42.1
NetC158_1: C158.1 R85.1 R88.2
NetC158_2: C158.2 R86.1 R89.2
NetC160_1: C160.1 IC29.21(OUT-) L41.2
NetC160_2: C160.2 C161.2 L43.1
NetC162_2: C162.2 C163.1 IC31.3(AIN+) R88.1
NetC163_2: C163.2 C164.1 IC31.4(AIN-) R89.1
NetC165_1: C165.1 L42.2 L44.1
NetC165_2: C165.2 L43.2 L45.1
NetC166_1: C166.1 IC30.1(VIN) IC30.3(EN) IC31.1(VREF) L58.1
NetC167_1: C167.1 L44.2 R90.2 R91.2
NetC167_2: C167.2 L45.2 R90.1 R92.2
NetC168_1: C168.1 IC30.5(VOUT) IC31.2(AVDD) TP18.TP
NetC231_1: IC27.2(EN) IC28.7(SHDN) ; port PORT2MIX2_EN
NetC233_1: IC29.9(ENBL) ; port PORT2MIX1_EN
NetIC27_3: IC27.3(IN+) IC27.4(IN-) L38.1 L39.1 R91.1 R92.1 R93.1 R93.2
NetIC29_11: IC29.11(DETO) R84.2
NetIC31_6: IC31.6(CONVST) ; port PORT2_CONVSTART
NetIC31_7: IC31.7(SDO) ; port PORT2_SDO
NetIC31_8: IC31.8(SCLK) ; port PORT2_SCLK
NetR40_1: R40.1(IN) R72.2 R73.2
NetR73_1: R73.1 R76.1 T2.6(OUT-)

### Notes on the sheet
- -3db pad
- Return loss bridge
- Downconverter to 1.IF (ca. 60MHz)
- 60MHz lowpass and conversion from
  250 Ohm to 28 Ohm impedance
- (28 Ohm impedance)
- -10db pad
- Cut wire if attenuator placed
- (near IC27) P1db: 0dbm
- 1MS/s ADC
- VNA
- Port 2
- Downconverter to 1.IF (ca. 250kHz)
- Final IF amplifier and ADC driver
- 300kHz lowpass
- Sheet:
- 04.05.2025 20:03:37
- 7

### Library data of the parts
C133-C169 = C-EU*?:2C0402: as C4 on sheet VNA_0; DeviceName: C0402; LibraryName: VNA; DeviceSetName: C-EU*?:2
IC27 = LT5560: GateName_1: G$1; SymbolName_1: LT5560; LibraryName: VNA; DeviceSetName: LT5560
IC28 = THS4521IDGKR: as IC23 on sheet VNA_5; LibraryName: VNA; DeviceSetName: THS4521IDGKR; V+: V+; V-: V-
IC29 = ADL5801: GateName_1: G$1; SymbolName_1: ADL5801; LibraryName: VNA; DeviceSetName: ADL5801
IC30 = NCP702: GateName_1: G$1; SymbolName_1: VREG_EN; LibraryName: VNA; DeviceSetName: NCP702; GND: GND
IC31 = MCP33131D-10-E/MS: GateName_1: G$1; SymbolName_1: MCP33131D-10-E/MS; LibraryName: VNA; DeviceSetName: MCP33131D-10-E/MS
J3 = BU-1420701851: GateName_1: G$1; SymbolName_1: BNC-FGND; LibraryName: VNA; DeviceSetName: BU-1420701851
L38-L45 = INDUCTOR0402: as L14 on sheet VNA_1; LibraryName: VNA; DeviceSetName: INDUCTOR
L54-L58 = FERRITE: GateName_1: G$1; SymbolName_1: L-EU:1; LibraryName: VNA; DeviceSetName: FERRITE
R40 R47 = PAT0816-C-3DB-T5: as R48 on sheet VNA_5; LibraryName: VNA; DeviceSetName: PAT0816-C-3DB-T5; Ď€: Ď€
R72 R73 R76 R80-R93 = R-EU_R0402: as R1 on sheet VNA_0; DeviceName: R0402; LibraryName: VNA
T2 = B012-617DB-1-63-B331: GateName_1: G$1; SymbolName_1: BALUN_1:1; LibraryName: VNA; DeviceSetName: B012-617DB-1-63-B331
TP18 = TPB1,27: as TP1 on sheet VNA_0; DeviceName: B1,27; LibraryName: VNA; DeviceSetName: TP

## Sheet VNA_7.SchDoc: VNA
size 409 x 289 mm; Origin: Eagle; OriginPath: C:\Users\Ground Lab\Desktop\LibreVNA\Hardware\Eagle\VNA.sch; OriginSheet: 8; OriginDescription: Ref Signal; Date: 04.05.2025 20:03:37; SheetNumber: 8; GateName_1: G$1; SymbolName_1: A3L-LOC; LibraryName: VNA; DeviceSetName: A3L-LOC; Sheet: Sheet:
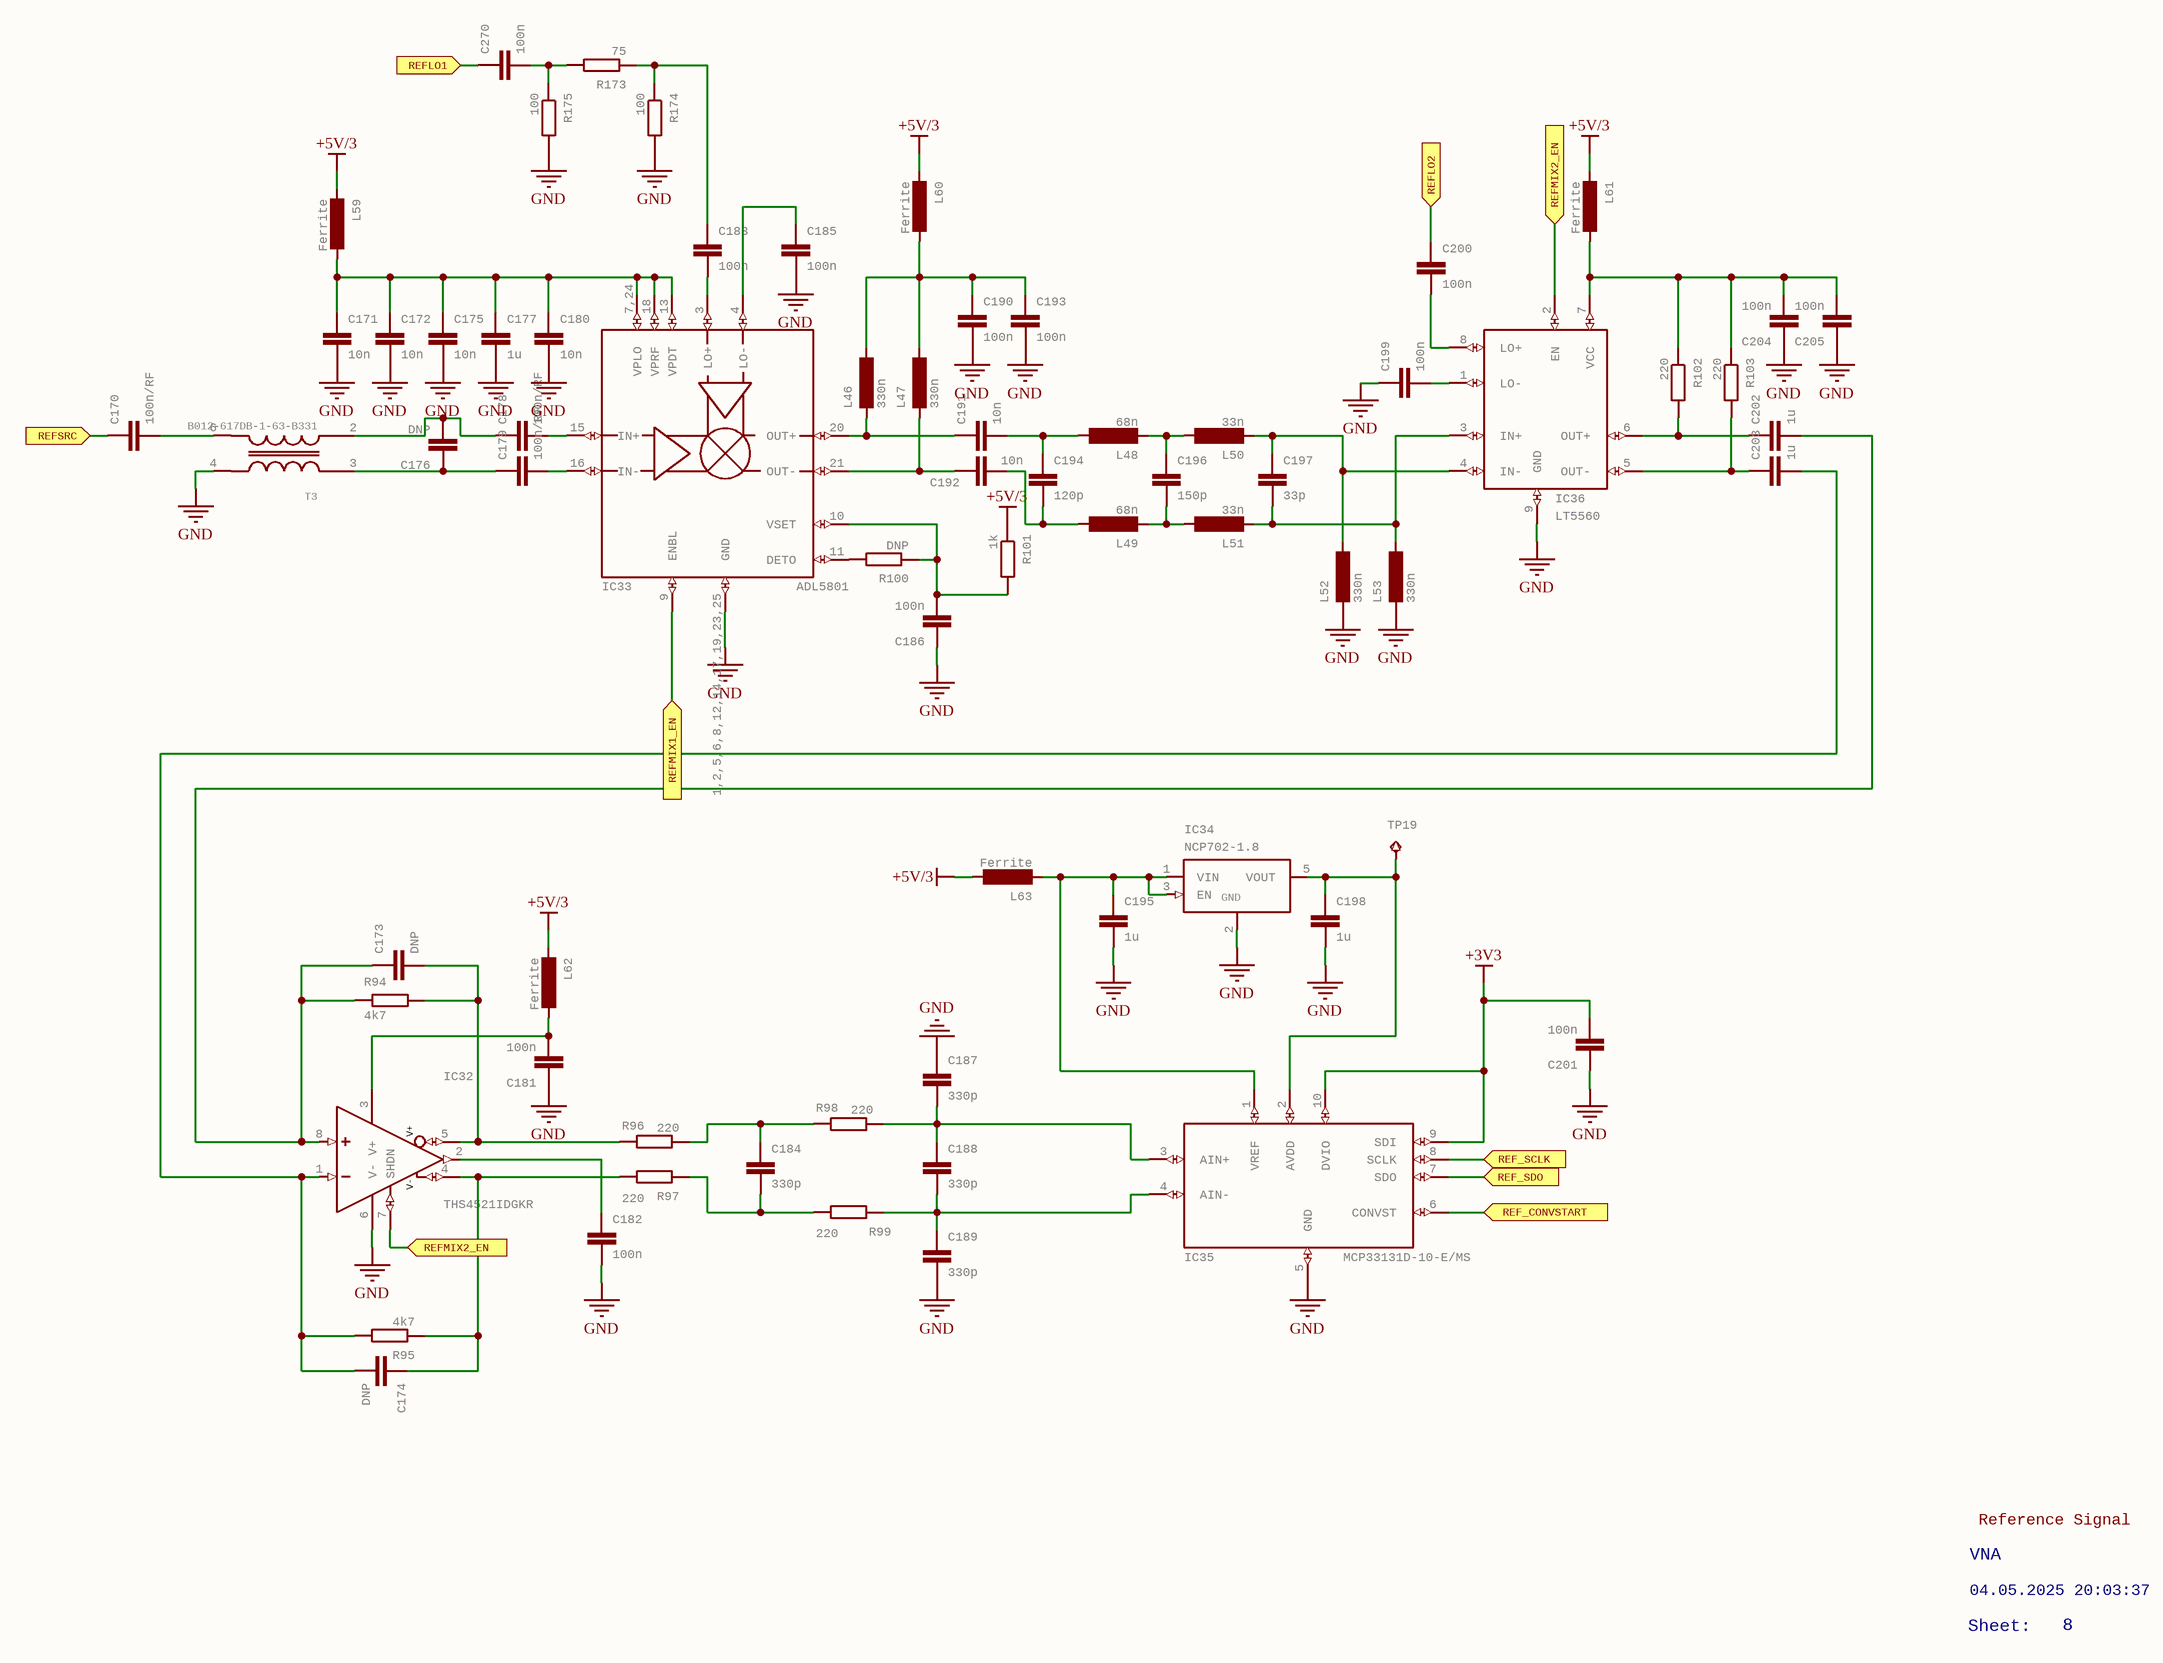
[diagram p7: VNA_7.SchDoc]

### Parts
C170  100n/RF  [C0402]
C171  10n  [C0402]
C172  10n  [C0402]
C173  DNP  [C0402]
C174  DNP  [C0402]
C175  10n  [C0402]
C176  DNP  [C0402]
C177  1u  [C0402]
C178  100n/RF  [C0402]
C179  100n/RF  [C0402]
C180  10n  [C0402]
C181  100n  [C0402]
C182  100n  [C0402]
C183  100n  [C0402]
C184  330p  [C0402]
C185  100n  [C0402]
C186  100n  [C0402]
C187  330p  [C0402]
C188  330p  [C0402]
C189  330p  [C0402]
C190  100n  [C0402]
C191  10n  [C0402]
C192  10n  [C0402]
C193  100n  [C0402]
C194  120p  [C0402]
C195  1u  [C0402]
C196  150p  [C0402]
C197  33p  [C0402]
C198  1u  [C0402]
C199  100n  [C0402]
C200  100n  [C0402]
C201  100n  [C0402]
C202  1u  [C0402]
C203  1u  [C0402]
C204  100n  [C0402]
C205  100n  [C0402]
C270  100n  [C0402]
IC32  THS4521IDGKR  [SOP65P490X110-8N]
IC33  ADL5801  [QFN50P400X400X100-25T250N]
IC34  NCP702-1.8  [SOT95P240X110-5]
IC35  MCP33131D-10-E/MS  [SOP50P490X110-10N]
IC36  LT5560  [SON50P300X300X80-9T165X238]
L46  330n  [L0402]
L47  330n  [L0402]
L48  68n  [L0402]
L49  68n  [L0402]
L50  33n  [L0402]
L51  33n  [L0402]
L52  330n  [L0402]
L53  330n  [L0402]
L59  Ferrite  [R0402]
L60  Ferrite  [R0402]
L61  Ferrite  [R0402]
L62  Ferrite  [R0402]
L63  Ferrite  [R0402]
R94  4k7  [R0402]
R95  4k7  [R0402]
R96  220  [R0402]
R97  220  [R0402]
R98  220  [R0402]
R99  220  [R0402]
R100  DNP  [R0402]
R101  1k  [R0402]
R102  220  [R0402]
R103  220  [R0402]
R173  75  [R0402]
R174  100  [R0402]
R175  100  [R0402]
T3  B012-617DB-1-63-B331  [EASTEVER_BALUN]
TP19  TPB1,27  [B1,27]  (value not drawn)

### Ports
REF_CONVSTART (in), REF_SCLK (in), REF_SDO (in), REFLO1 (in), REFLO2 (in), REFMIX1_EN (in), REFMIX2_EN (in), REFSRC (in)

### Nets
+3V3: C201.2 IC35.9(SDI) IC35.10(DVIO)
+5V/3: L59.2 L60.2 L61.2 L62.2 L63.1 R101.1
GND: C171.2 C172.2 C175.2 C177.2 C180.2 C181.1 C182.2 C185.2 C186.1 C187.1 C189.2 C190.2 C193.2 C195.2 C198.2 C199.1 C201.1 C204.1 C205.1 IC32.6(V-) IC33.1,2,5,6,8,12,14,17,19,23,25(GND) IC34.2(GND) IC35.5(GND) IC36.9(GND) L52.2 L53.2 R174.2 R175.2 T3.4(OUT+)
NetC45_1: C200.1 ; port REFLO2
NetC170_1: C170.1 ; port REFSRC
NetC170_2: C170.2 T3.6(OUT-)
NetC171_1: C171.1 C172.1 C175.1 C177.1 C180.1 IC33.7,24(VPLO) IC33.13(VPDT) IC33.18(VPRF) L59.1
NetC173_1: C173.1 C202.2 IC32.8(+IN) R94.1
NetC173_2: C173.2 IC32.5(-OUT) R94.2 R96.2
NetC174_1: C174.1 IC32.4(+OUT) R95.1 R97.2
NetC174_2: C174.2 C203.2 IC32.1(-IN) R95.2
NetC176_1: C176.1 C179.1 T3.3(IN+)
NetC176_2: C176.2 C178.1 T3.2(IN-)
NetC178_2: C178.2 IC33.15(IN+)
NetC179_2: C179.2 IC33.16(IN-)
NetC181_2: C181.2 IC32.3(V+) L62.1
NetC182_1: C182.1 IC32.2(VOCM)
NetC183_1: C183.1 R173.1 R174.1
NetC183_2: C183.2 IC33.3(LO+)
NetC184_1: C184.1 R96.1 R98.2
NetC184_2: C184.2 R97.1 R99.2
NetC185_1: C185.1 IC33.4(LO-)
NetC186_2: C186.2 IC33.10(VSET) R100.1 R101.2
NetC187_2: C187.2 C188.1 IC35.3(AIN+) R98.1
NetC188_2: C188.2 C189.1 IC35.4(AIN-) R99.1
NetC190_1: C190.1 C193.1 L46.1 L47.1 L60.1
NetC191_1: C191.1 IC33.20(OUT+) L46.2
NetC191_2: C191.2 C194.1 L48.1
NetC192_1: C192.1 IC33.21(OUT-) L47.2
NetC192_2: C192.2 C194.2 L49.1
NetC195_1: C195.1 IC34.1(VIN) IC34.3(EN) IC35.1(VREF) L63.2
NetC196_1: C196.1 L48.2 L50.1
NetC196_2: C196.2 L49.2 L51.1
NetC197_1: C197.1 C197.2 IC36.3(IN+) IC36.4(IN-) L50.2 L51.2 L52.1 L53.1
NetC198_1: C198.1 IC34.5(VOUT) IC35.2(AVDD) TP19.TP
NetC199_2: C199.2 IC36.1(LO-)
NetC200_2: C200.2 IC36.8(LO+)
NetC202_1: C202.1 IC36.6(OUT+) R102.2
NetC203_1: C203.1 IC36.5(OUT-) R103.2
NetC204_2: C204.2 C205.2 IC36.7(VCC) L61.1 R102.1 R103.1
NetC224_1: IC32.7(SHDN) IC36.2(EN) ; port REFMIX2_EN
NetC226_1: IC33.9(ENBL) ; port REFMIX1_EN
NetC270_1: C270.1 ; port REFLO1
NetC270_2: C270.2 R173.2 R175.1
NetIC33_11: IC33.11(DETO) R100.2
NetIC35_6: IC35.6(CONVST) ; port REF_CONVSTART
NetIC35_7: IC35.7(SDO) ; port REF_SDO
NetIC35_8: IC35.8(SCLK) ; port REF_SCLK

### Notes on the sheet
- VNA
- Reference Signal
- Sheet:
- 04.05.2025 20:03:37
- 8

### Library data of the parts
C170-C205 C270 = C-EU*?:2C0402: as C4 on sheet VNA_0; DeviceName: C0402; LibraryName: VNA; DeviceSetName: C-EU*?:2
IC32 = THS4521IDGKR: as IC23 on sheet VNA_5; LibraryName: VNA; DeviceSetName: THS4521IDGKR; V+: V+; V-: V-
IC33 = ADL5801: GateName_1: G$1; SymbolName_1: ADL5801; LibraryName: VNA; DeviceSetName: ADL5801
IC34 = NCP702: GateName_1: G$1; SymbolName_1: VREG_EN; LibraryName: VNA; DeviceSetName: NCP702; GND: GND
IC35 = MCP33131D-10-E/MS: GateName_1: G$1; SymbolName_1: MCP33131D-10-E/MS; LibraryName: VNA; DeviceSetName: MCP33131D-10-E/MS
IC36 = LT5560: GateName_1: G$1; SymbolName_1: LT5560; LibraryName: VNA; DeviceSetName: LT5560
L46-L53 = INDUCTOR0402: as L14 on sheet VNA_1; LibraryName: VNA; DeviceSetName: INDUCTOR
L59-L63 = FERRITE: GateName_1: G$1; SymbolName_1: L-EU:1; LibraryName: VNA; DeviceSetName: FERRITE
R94-R103 R173-R175 = R-EU_R0402: as R1 on sheet VNA_0; DeviceName: R0402; LibraryName: VNA
T3 = B012-617DB-1-63-B331: GateName_1: G$1; SymbolName_1: BALUN_1:1; LibraryName: VNA; DeviceSetName: B012-617DB-1-63-B331
TP19 = TPB1,27: as TP1 on sheet VNA_0; DeviceName: B1,27; LibraryName: VNA; DeviceSetName: TP